# EAGLE board PXF_v2.0 (EAGLE 7.1.0), part 1 of 2
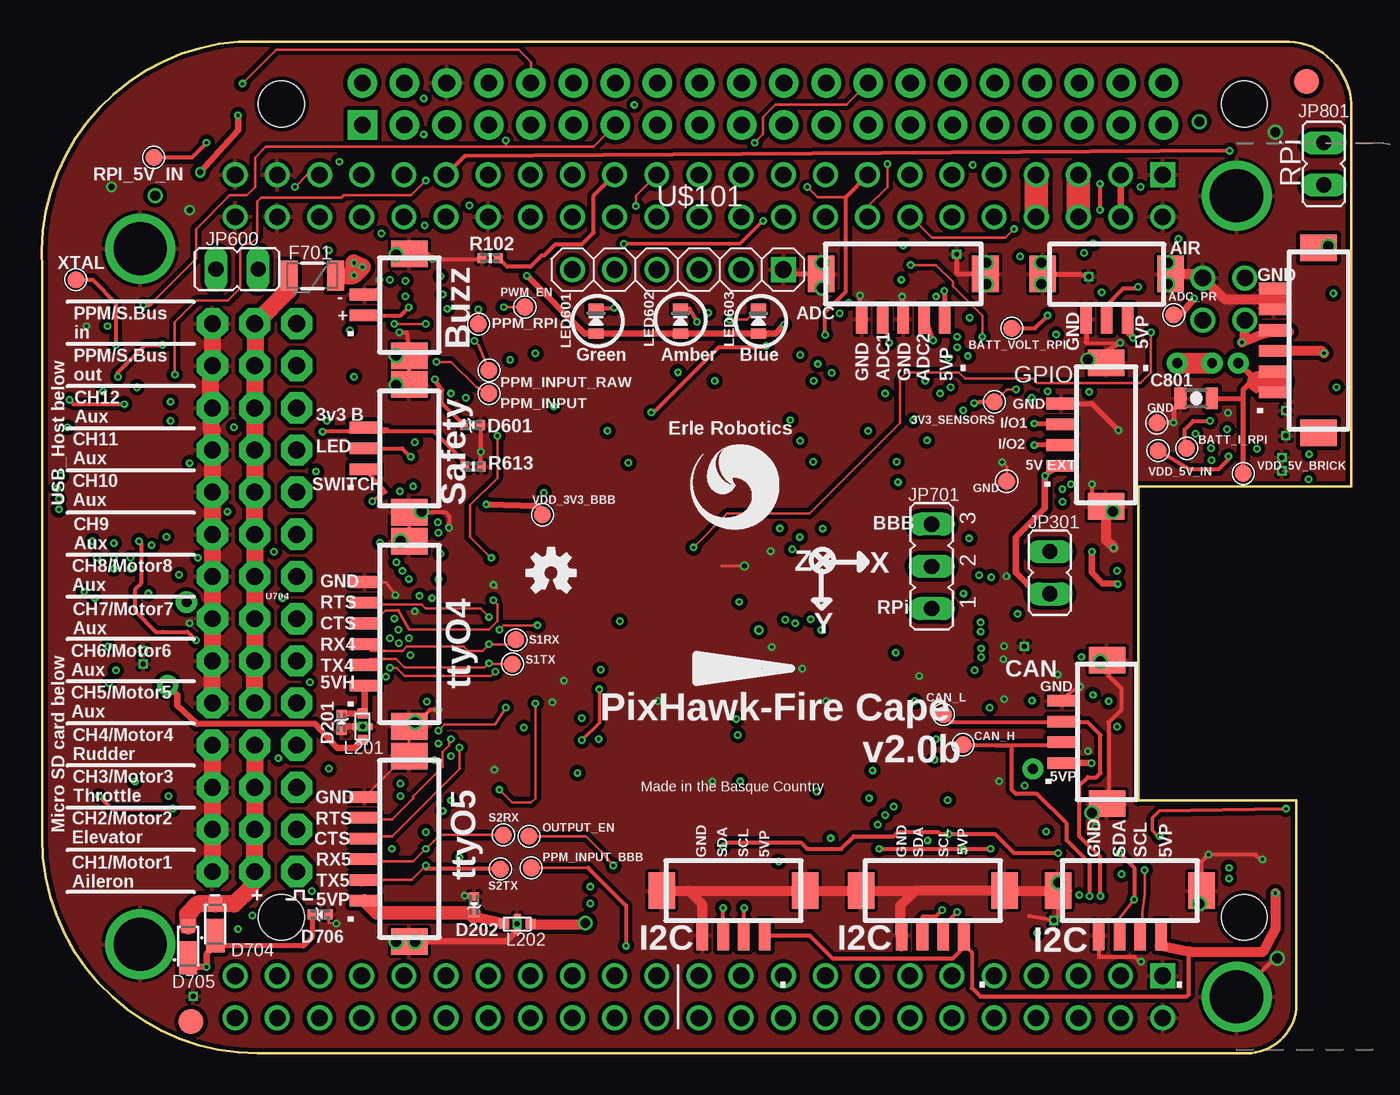
[diagram p9: board, top side]
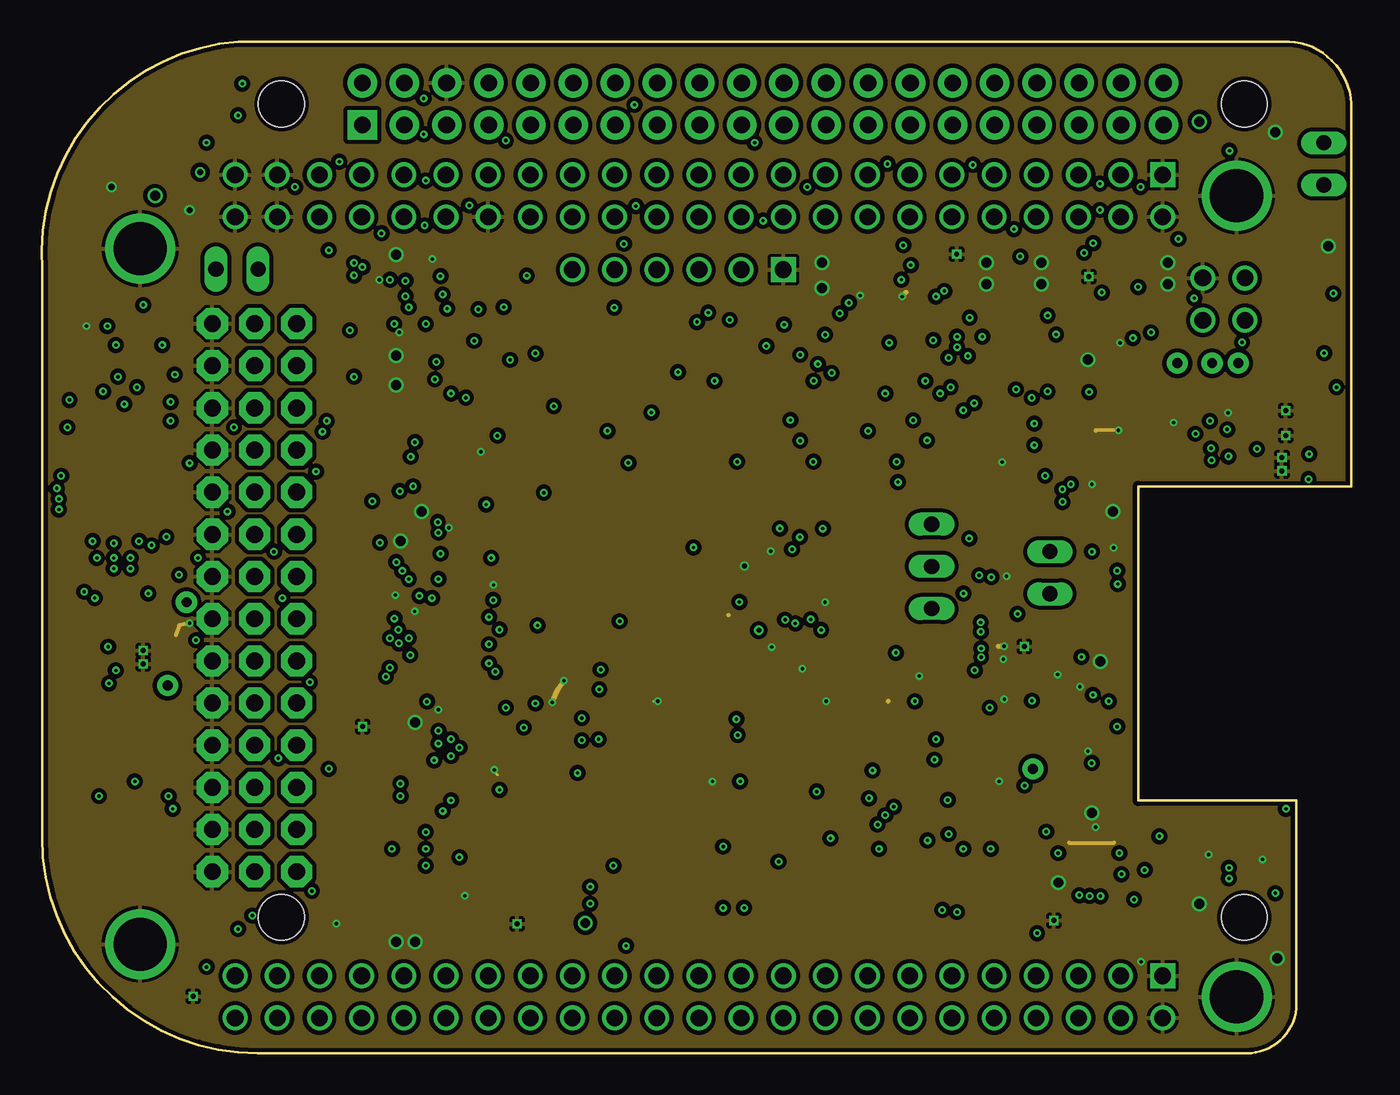
[diagram p10: board, inner layer Ground]
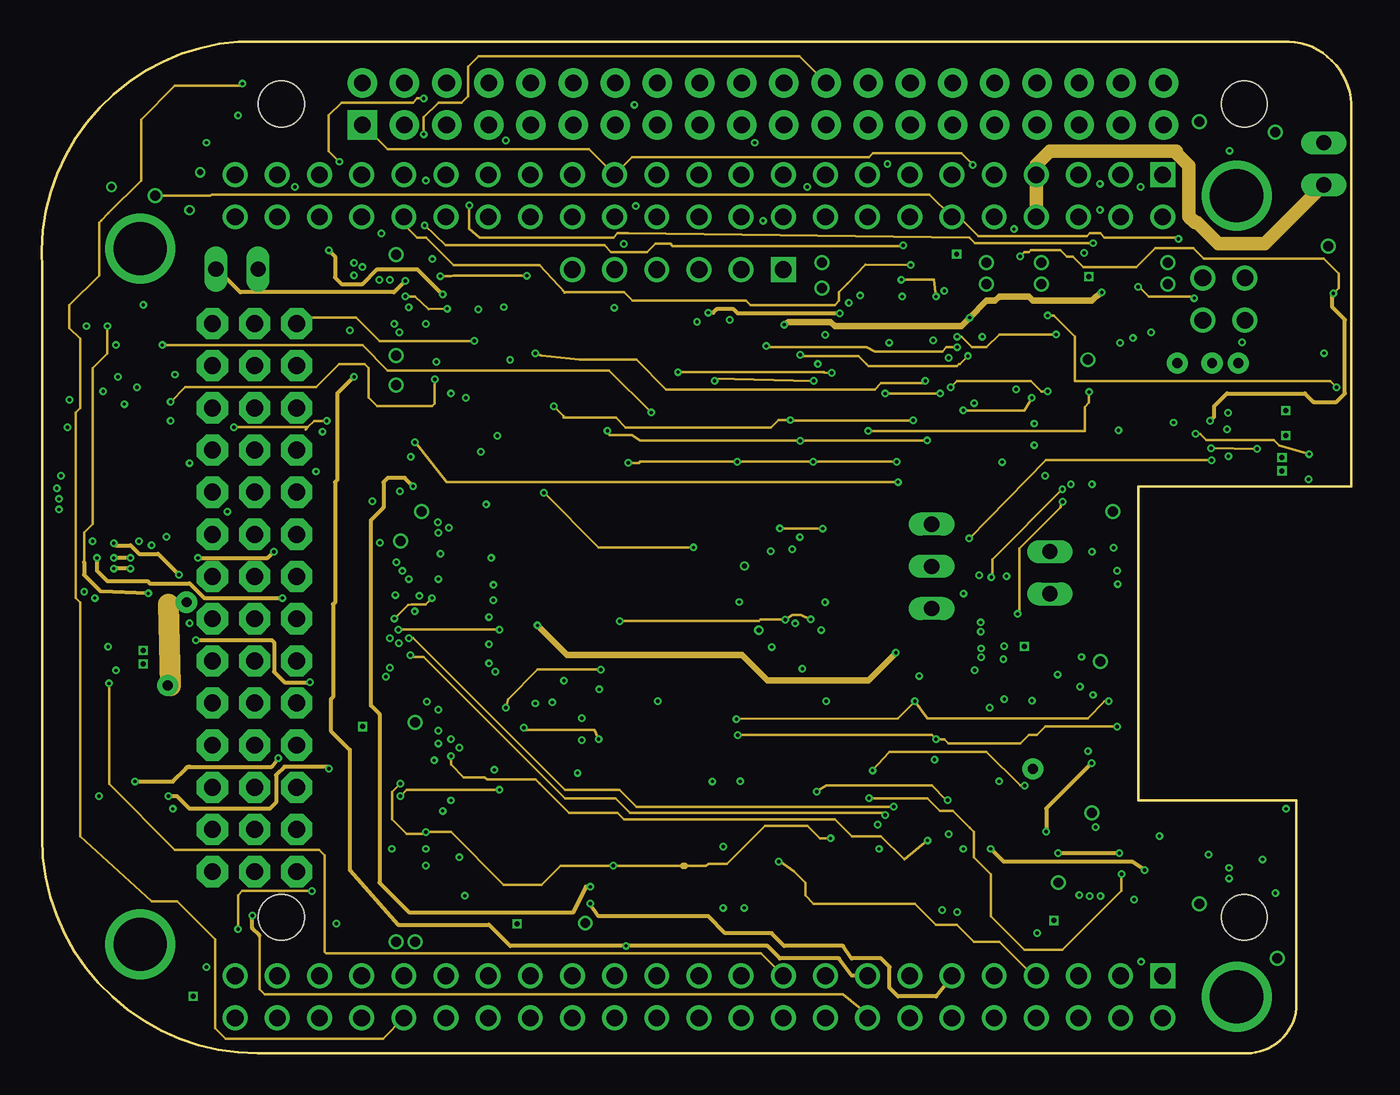
[diagram p11: board, inner layer Horizontal]
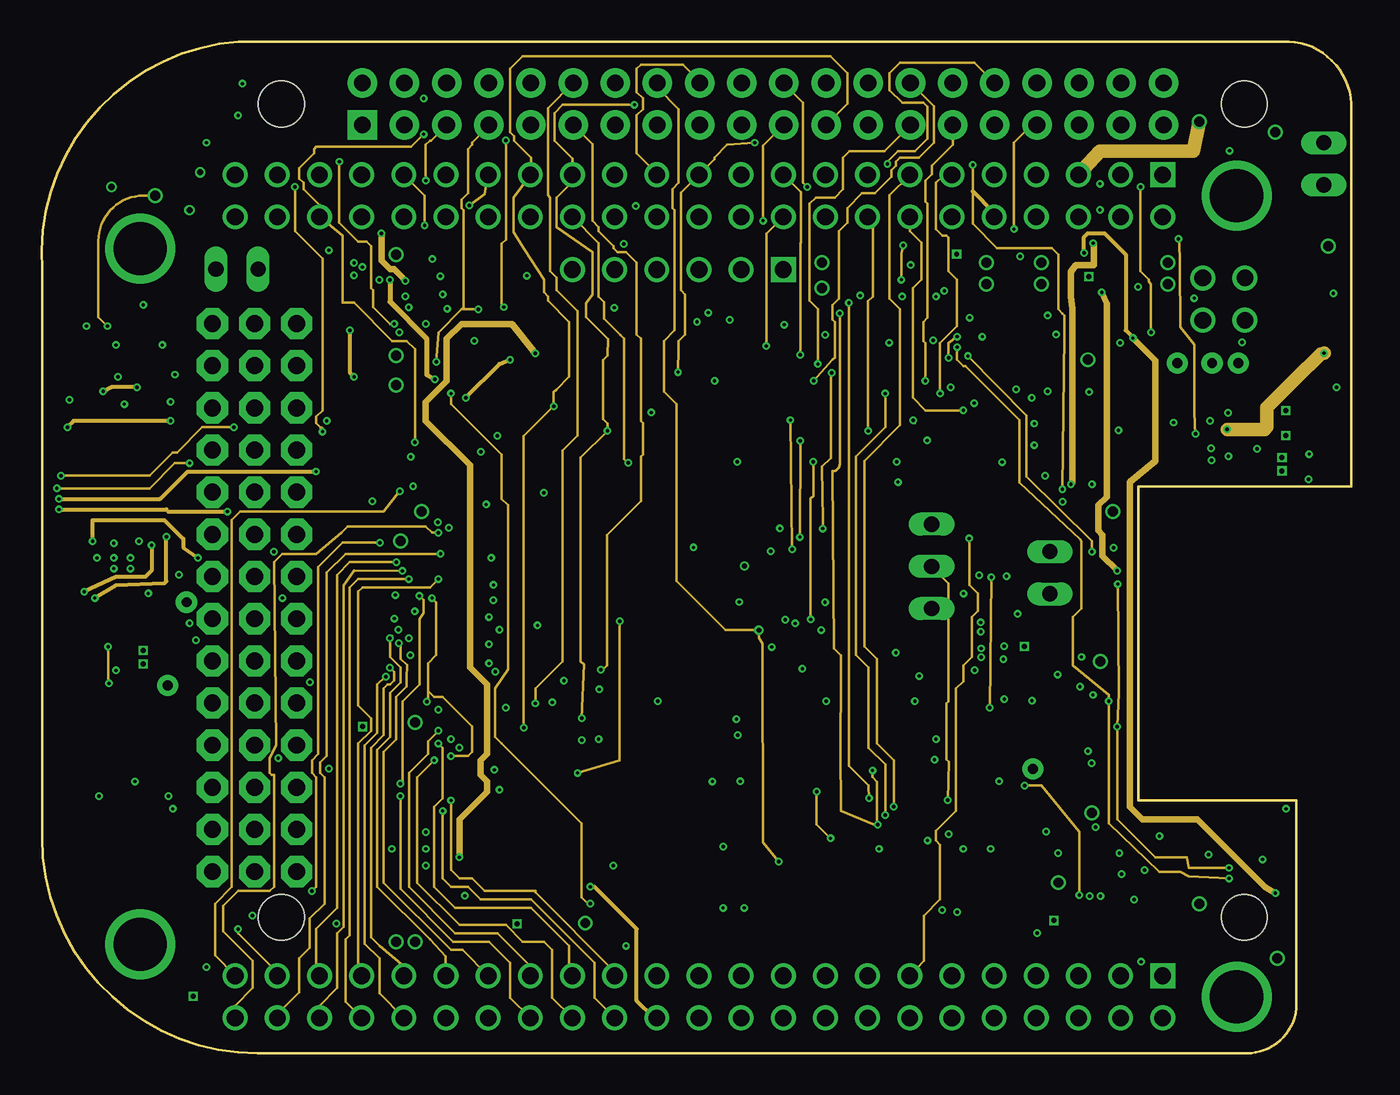
[diagram p12: board, inner layer Vertical]
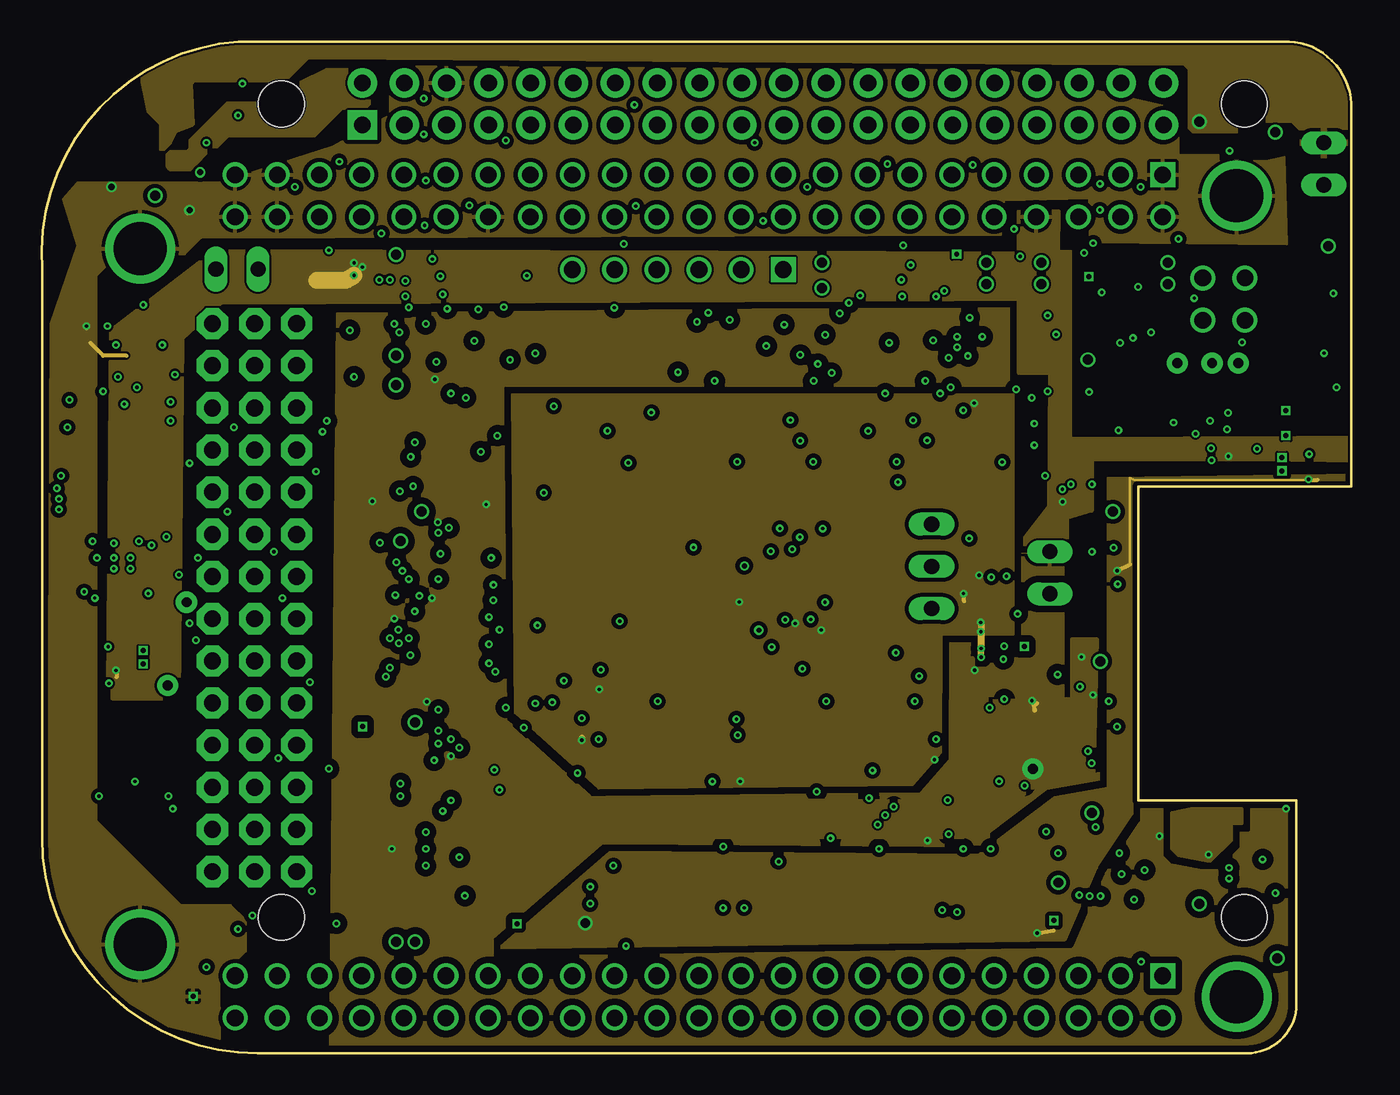
[diagram p13: board, inner layer Power]
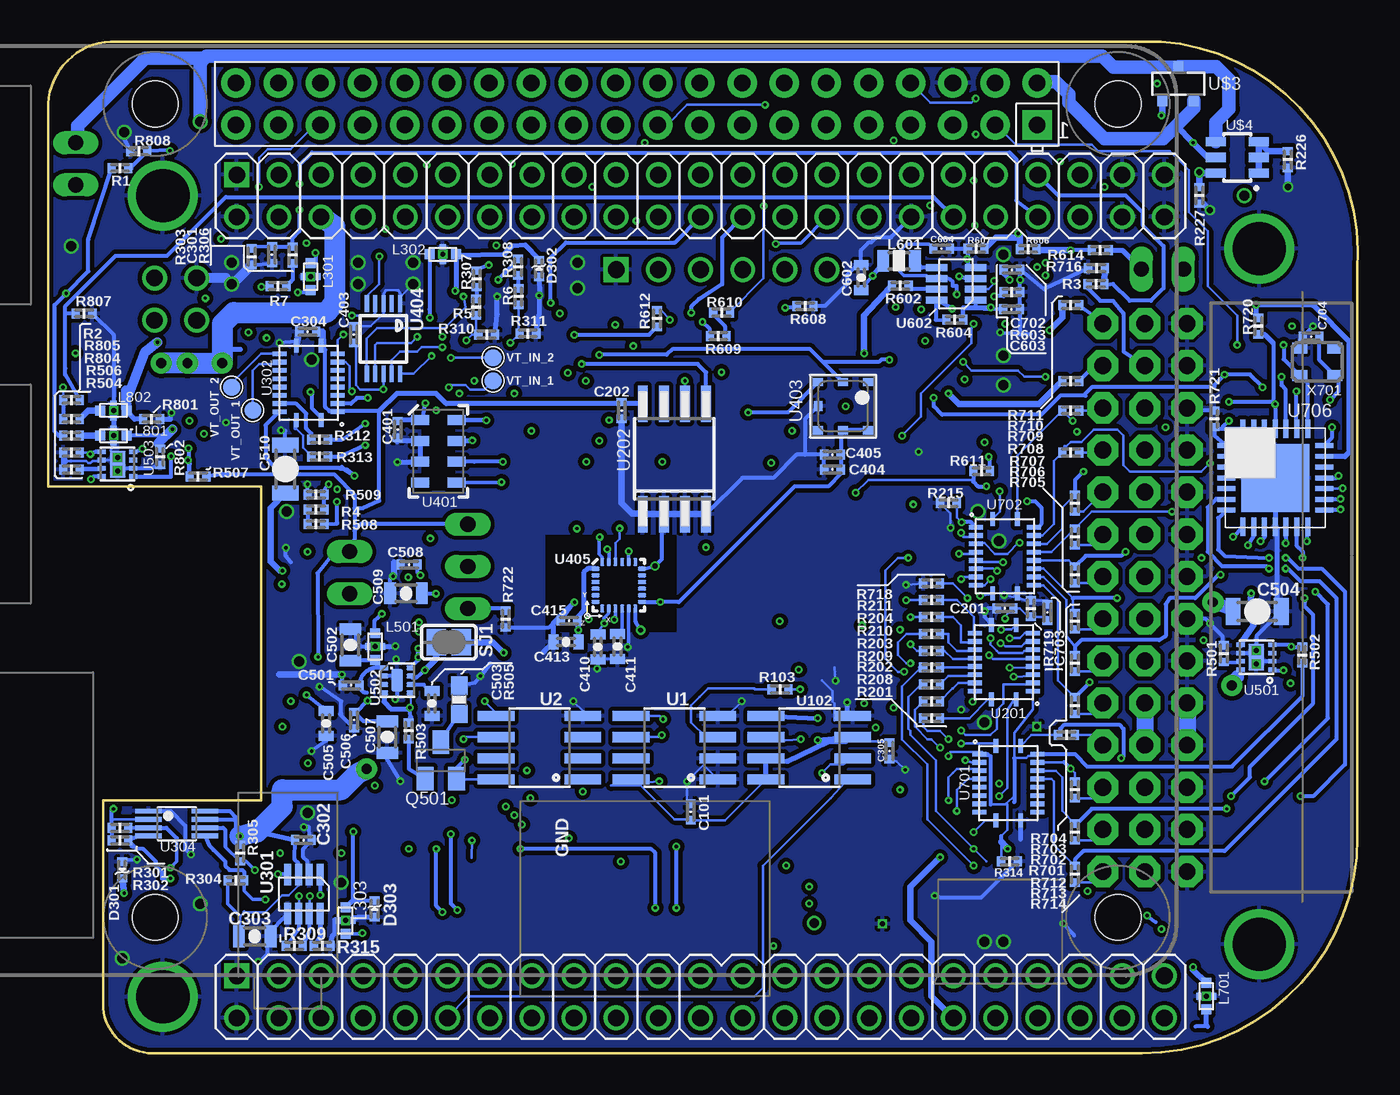
[diagram p14: board, bottom side, seen from below]

Size 78.9 x 60.96 mm. Coordinates in mm from the lower left corner, seen from the top.
Outline: 74.76,60.96 11.89,60.96 arc90 0.03,47.2 0.03,13 arc90 13.03,0 72.6,0 arc90 75.6,3 75.6,15.24 66.07,15.24 66.07,34.16 78.9,34.16 78.9,57.2 arc90 74.76,60.96
Copper layers (1*2*3*14*15*16): Top 0.035mm / dielectric 0.5mm / Ground 0.035mm / dielectric 0.15mm / Horizontal 0.035mm / dielectric 0.15mm / Vertical 0.035mm / dielectric 0.15mm / Power 0.035mm / dielectric 0.5mm / Bottom 0.035mm
Design rules "3DR 5mil *": minimum track width 0.125mm, minimum drill 0.15mm, track to track 4mil, track to pad 4mil, pad to pad 4mil, via to via 4mil, smd to smd 1mil, copper to edge 0.125mm, drill to drill 0.125mm, minimum pad ring 0.125mm, minimum via ring 0.125mm, stop-mask expansion 1mil, vias tented up to drill 0.31mm, thermal gap 8mil
Net classes: 0 signal: width 0.127 mm, drill 0.2 mm, clearance 0.127 mm; 1 power: width 0.127 mm, drill 0.2 mm, clearance 0.127 mm

## Footprints (pad centres in the part's own frame; a part is rotated, then mirrored left to right if it is on the bottom)
PAD.04X.04 = smd 1.016 x 1.016: P$1 0,0
0402-CAP = smd 0.5 x 0.6: P$1 -0.5,0; P$2 0.5,0
0805-CAP = smd 0.7 x 1.3: P$1 -0.95,0; P$2 0.95,0
0603-CAP = smd 0.6 x 0.9: P$1 -0.75,0; P$2 0.75,0
1206-CAP = smd 0.9 x 1.6: P$1 -1.45,0; P$2 1.45,0
0402-TVS = smd 0.5 x 0.6: A 0.5,0; C -0.5,0
MICROSMP = smd 0.8 x 0.8: ANODE 0.65,0 | smd 2 x 1.1: CATHODE -1.25,0
PTC-1206 = smd 1 x 1.8: 1 -1.4,0; 2 1.4,0
DF13C-3P-1.25V = smd 0.7 x 1.8: 1 -1.25,0.9; 2 0,0.9; 3 1.25,0.9 | smd 1.6 x 2.2: P$4 -3.85,-1.8; P$5 3.85,-1.8
DF13C-4P-1.25V = smd 0.7 x 1.8: 1 -1.875,0.9; 2 -0.625,0.9; 3 0.625,0.9; 4 1.875,0.9 | smd 1.6 x 2.2: P$5 -4.325,-1.8; P$6 4.325,-1.8
DF13C-5P-1.25V = smd 0.7 x 1.8: 1 -2.5,0.9; 2 -1.25,0.9; 3 0,0.9; 4 1.25,0.9; 5 2.5,0.9 | smd 1.6 x 2.2: P$6 -4.95,-1.8; P$7 4.95,-1.8
DF13C-6P-1.25V = smd 0.7 x 1.8: 1 -3.125,0.9; 2 -1.875,0.9; 3 -0.625,0.9; 4 0.625,0.9; 5 1.875,0.9; 6 3.125,0.9 | smd 1.6 x 2.2: M$0 5.575,-1.8; M$1 -5.575,-1.8
JP1 = drill 0.914 long: 1 0,-1.27; 2 0,1.27
JP2 = drill 0.914 long: 1 -2.54,0; 2 0,0; 3 2.54,0
FIDUCIAL-1.5X3 = smd 1.5 x 1.5: 1 0,0
KYOCERA-KNH16-DA = smd 0.6 x 0.6: P$1 -0.8,0; P$2 0.8,0 | smd 0.4 x 0.4: P$3 0,-0.4; P$4 0,0.4 | drill 0.3 pad 0.4 square: P$5 0,0
0805-IND = smd 0.7 x 1.3: P$1 -0.95,0; P$2 0.95,0
0603-LED = smd 0.6 x 0.9: A 0.75,0; C -0.75,0
SOT23-BEC = smd 1 x 1.4: B -0.95,-1.1; C 0,1.1; E 0.95,-1.1
0402-RES = smd 0.5 x 0.6: P$1 -0.5,0; P$2 0.5,0
0603-RES = smd 1.1 x 1: 1 -0.85,0; 2 0.85,0
SOLDERJUMPER_CLOSEDWIRE = smd 1.168 x 1.6: 1 -0.762,0; 2 0.762,0 | smd 0.635 x 0.203: WIRE 0,0
SO08 = smd 0.61 x 2.21: 1 -1.905,-2.616; 2 -0.635,-2.616; 3 0.635,-2.616; 4 1.905,-2.616; 5 1.905,2.616; 6 0.635,2.616; 7 -0.635,2.616; 8 -1.905,2.616
QFN20-RGY = smd 0.28 x 0.85: 1 -0.75,2.25; 10 -0.75,-2.25; 11 0.75,-2.25; 20 0.75,2.25 | smd 0.85 x 0.28: 2 -1.75,1.75; 3 -1.75,1.25; 4 -1.75,0.75; 5 -1.75,0.25; 6 -1.75,-0.25; 7 -1.75,-0.75; 8 -1.75,-1.25; 9 -1.75,-1.75; 12 1.75,-1.75; 13 1.75,-1.25; 14 1.75,-0.75; 15 1.75,-0.25; 16 1.75,0.25; 17 1.75,0.75; 18 1.75,1.25; 19 1.75,1.75
SOIC8 = smd 0.6 x 2.2: 1 -1.905,-3.33; 2 -0.635,-3.33; 3 0.635,-3.33; 4 1.905,-3.33; 5 1.905,3.33; 6 0.635,3.33; 7 -0.635,3.33; 8 -1.905,3.33
SOT23-8 = smd 0.42 x 1.3: 1 -0.975,-1.175; 2 -0.325,-1.175; 3 0.325,-1.175; 4 0.975,-1.175; 5 0.975,1.175; 6 0.325,1.175; 7 -0.325,1.175; 8 -0.975,1.175
DCT = smd 0.3 x 1.6: P$1 0.52,-1.7; P$2 1.02,-1.7; P$3 1.52,-1.7; P$4 2.02,-1.7; P$5 2.02,1.7; P$6 1.52,1.7; P$7 1.02,1.7; P$8 0.52,1.7
MS5611-01BA = smd 1.1 x 0.6: 1 -1.1,1.875; 2 -1.1,0.625; 3 -1.1,-0.625; 4 -1.1,-1.875; 5 1.1,-1.875; 6 1.1,-0.625; 7 1.1,0.625; 8 1.1,1.875
BMP180 = smd 0.6 x 0.5: 1 1.5,1.45; 2 0,1.45; 3 -1.5,1.45; 4 -1.5,-1.45; 5 0,-1.45; 6 1.5,-1.45 | smd 0.5 x 0.6: 7 1.5,0
MSOP10 = smd 0.25 x 1: 1 -1,-2.113; 2 -0.5,-2.113; 3 0,-2.113; 4 0.5,-2.113; 5 1,-2.113; 6 1,2.113; 7 0.5,2.113; 8 0,2.113; 9 -0.5,2.113; 10 -1,2.113
MPU-6500 = smd 0.508 x 0.254: 1 -1.4,1; 2 -1.4,0.6; 3 -1.4,0.2; 4 -1.4,-0.2; 5 -1.4,-0.6; 6 -1.4,-1; 13 1.4,-1; 14 1.4,-0.6; 15 1.4,-0.2; 16 1.4,0.2; 17 1.4,0.6; 18 1.4,1 | smd 0.254 x 0.508: 7 -1,-1.4; 8 -0.6,-1.4; 9 -0.2,-1.4; 10 0.2,-1.4; 11 0.6,-1.4; 12 1,-1.4; 19 1,1.4; 20 0.6,1.4; 21 0.2,1.4; 22 -0.2,1.4; 23 -0.6,1.4; 24 -1,1.4
QFN8-DSG = smd 0.28 x 0.5: 1 -0.75,-0.95; 2 -0.25,-0.95; 3 0.25,-0.95; 4 0.75,-0.95; 5 0.75,0.95; 6 0.25,0.95; 7 -0.25,0.95; 8 -0.75,0.95 | smd 1.6 x 0.9: GND 0,0 | drill 0.3 square: P$2 -0.4,0; P$3 0.4,0
MLF-8-EPAD = smd 0.5 x 0.3: 1 -0.8,0.75; 2 -0.8,0.25; 3 -0.8,-0.25; 4 -0.8,-0.75; 5 0.8,-0.75; 6 0.8,-0.25; 7 0.8,0.25; 8 0.8,0.75 | smd 0.7 x 1.4: GND 0,0
3X14RA = drill 1.016 pad 1.88 octagon: 1 2.54,-16.51; 2 0,-16.51; 3 -2.54,-16.51; 4 2.54,-13.97; 5 0,-13.97; 6 -2.54,-13.97; 7 2.54,-11.43; 8 0,-11.43; 9 -2.54,-11.43; 10 2.54,-8.89; 11 0,-8.89; 12 -2.54,-8.89; 13 2.54,-6.35; 14 0,-6.35; 15 -2.54,-6.35; 16 2.54,-3.81; 17 0,-3.81; 18 -2.54,-3.81; 19 2.54,-1.27; 20 0,-1.27; 21 -2.54,-1.27; 22 2.54,1.27; 23 0,1.27; 24 -2.54,1.27; 25 2.54,3.81; 26 0,3.81; 27 -2.54,3.81; 28 2.54,6.35; 29 0,6.35; 30 -2.54,6.35; 31 2.54,8.89; 32 0,8.89; 33 -2.54,8.89; 34 2.54,11.43; 35 0,11.43; 36 -2.54,11.43; 37 2.54,13.97; 38 0,13.97; 39 -2.54,13.97; 40 2.54,16.51; 41 0,16.51; 42 -2.54,16.51
HVQFN28 = smd 1.1 x 0.3: 1 -2.95,1.95; 2 -2.95,1.3; 3 -2.95,0.65; 4 -2.95,0; 5 -2.95,-0.65; 6 -2.95,-1.3; 7 -2.95,-1.95; 15 2.95,-1.95; 16 2.95,-1.3; 17 2.95,-0.65; 18 2.95,0; 19 2.95,0.65; 20 2.95,1.3; 21 2.95,1.95 | smd 0.3 x 1.1: 8 -1.95,-2.95; 9 -1.3,-2.95; 10 -0.65,-2.95; 11 0,-2.95; 12 0.65,-2.95; 13 1.3,-2.95; 14 1.95,-2.95; 22 1.95,2.95; 23 1.3,2.95; 24 0.65,2.95; 25 0,2.95; 26 -0.65,2.95; 27 -1.3,2.95; 28 -1.95,2.95 | smd 4.1 x 4.1: PAD 0,0
DF13C-6P-1.25V' = smd 0.7 x 1.8: 1 -3.125,0.9; 2 -1.875,0.9; 3 -0.625,0.9; 4 0.625,0.9; 5 1.875,0.9; 6 3.125,0.9 | smd 1.6 x 2.2: P$7 -5.575,-1.8; P$8 5.575,-1.8
SOT23 = smd 0.6 x 0.7: D 0,1; G -0.95,-1; S 0.95,-1
SOT26 = smd 0.55 x 1.2: 1 2.22,-1.3; 2 1.27,-1.3; 3 0.32,-1.3; 4 0.32,1.3; 5 1.27,1.3; 6 2.22,1.3
DF13C-2P-1.25V = smd 0.7 x 1.8: 1 -0.625,0.9; 2 0.625,0.9 | smd 1.6 x 2.2: P$3 -3.075,-1.8; P$4 3.075,-1.8
BEAGLEBONE_SHIELD = drill 1 square: 1 4.445,19.05; 47 52.705,19.05; 93 46.99,41.91 | drill 1: 2 1.905,19.05; 3 4.445,21.59; 4 1.905,21.59; 5 4.445,24.13; 6 1.905,24.13; 7 4.445,26.67; 8 1.905,26.67; 9 4.445,29.21; 10 1.905,29.21; 11 4.445,31.75; 12 1.905,31.75; 13 4.445,34.29; 14 1.905,34.29; 15 4.445,36.83; 16 1.905,36.83; 17 4.445,39.37; 18 1.905,39.37; 19 4.445,41.91; 20 1.905,41.91; 21 4.445,44.45; 22 1.905,44.45; 23 4.445,46.99; 24 1.905,46.99; 25 4.445,49.53; 26 1.905,49.53; 27 4.445,52.07; 28 1.905,52.07; 29 4.445,54.61; 30 1.905,54.61; 31 4.445,57.15; 32 1.905,57.15; 33 4.445,59.69; 34 1.905,59.69; 35 4.445,62.23; 36 1.905,62.23; 37 4.445,64.77; 38 1.905,64.77; 39 4.445,67.31; 40 1.905,67.31; 41 4.445,69.85; 42 1.905,69.85; 43 4.445,72.39; 44 1.905,72.39; 45 4.445,74.93; 46 1.905,74.93; 48 50.165,19.05; 49 52.705,21.59; 50 50.165,21.59; 51 52.705,24.13; 52 50.165,24.13; 53 52.705,26.67; 54 50.165,26.67; 55 52.705,29.21; 56 50.165,29.21; 57 52.705,31.75; 58 50.165,31.75; 59 52.705,34.29; 60 50.165,34.29; 61 52.705,36.83; 62 50.165,36.83; 63 52.705,39.37; 64 50.165,39.37; 65 52.705,41.91; 66 50.165,41.91; 67 52.705,44.45; 68 50.165,44.45; 69 52.705,46.99; 70 50.165,46.99; 71 52.705,49.53; 72 50.165,49.53; 73 52.705,52.07; 74 50.165,52.07; 75 52.705,54.61; 76 50.165,54.61; 77 52.705,57.15; 78 50.165,57.15; 79 52.705,59.69; 80 50.165,59.69; 81 52.705,62.23; 82 50.165,62.23; 83 52.705,64.77; 84 50.165,64.77; 85 52.705,67.31; 86 50.165,67.31; 87 52.705,69.85; 88 50.165,69.85; 89 52.705,72.39; 90 50.165,72.39; 91 52.705,74.93; 92 50.165,74.93; 94 46.99,44.45; 95 46.99,46.99; 96 46.99,49.53; 97 46.99,52.07; 98 46.99,54.61; TP5 43.942,14.097; TP6 46.482,14.097; TP7 43.942,16.637; TP8 46.482,16.637 | drill 3.2: P$1 6.35,80.645; P$2 48.26,80.645; P$3 3.175,14.605; P$4 51.435,14.605
RASPI_BOARD_B+_FULL = drill 1 pad 1.778 square: 1 8.37,51.23 | drill 1 pad 1.778: 2 8.37,53.77; 3 10.91,51.23; 4 10.91,53.77; 5 13.45,51.23; 6 13.45,53.77; 7 15.99,51.23; 8 15.99,53.77; 9 18.53,51.23; 10 18.53,53.77; 11 21.07,51.23; 12 21.07,53.77; 13 23.61,51.23; 14 23.61,53.77; 15 26.15,51.23; 16 26.15,53.77; 17 28.69,51.23; 18 28.69,53.77; 19 31.23,51.23; 20 31.23,53.77; 21 33.77,51.23; 22 33.77,53.77; 23 36.31,51.23; 24 36.31,53.77; 25 38.85,51.23; 26 38.85,53.77; 27 41.39,51.23; 28 41.39,53.77; 29 43.93,51.23; 30 43.93,53.77; 31 46.47,51.23; 32 46.47,53.77; 33 49.01,51.23; 34 49.01,53.77; 35 51.55,51.23; 36 51.55,53.77; 37 54.09,51.23; 38 54.09,53.77; 39 56.63,51.23; 40 56.63,53.77 | hole 2.75: 3.5,3.5; 3.5,52.5; 61.5,3.5; 61.5,52.5
ASE = smd 0.9 x 0.65: 1 -1.05,-0.825; 2 1.05,-0.825; 3 1.05,0.825; 4 -1.05,0.825

## Placement (x,y rotation side)
3V3_SENSORS  PAD.04  [PAD.04X.04]  57.4,39.25 90 top
ADC_PR  PAD.04  [PAD.04X.04]  68.21,44.49 90 top
BATT_I_RPI  PAD.04  [PAD.04X.04]  68.99,36.45 0 top
BATT_VOLT_RPI  PAD.04  [PAD.04X.04]  58.45,43.69 0 top
C101  0u1  [0402-CAP]  40.2,14.55 90 bottom
C201  0u1  [0402-CAP]  21.26,26.82 180 bottom
C202  100nF  [0402-CAP]  44.36,38.73 270 bottom
C301  0u1  [0402-CAP]  65.42,48.11 270 bottom
C302  0u1  [0402-CAP]  63.53,12.85 0 bottom
C303  10u/10V  [0805-CAP]  66.45,7.05 0 bottom
C304  0u1  [0402-CAP]  63.27,43.47 180 bottom
C305  0u1  [0402-CAP]  28.23,18.22 270 bottom
C401  0u1  [0402-CAP]  57.84,37.59 270 bottom
C403  0u1  [0402-CAP]  60.49,43.31 90 bottom
C404  1u  [0402-CAP]  31.66,35.18 180 bottom
C405  0u1  [0402-CAP]  31.66,36.07 180 bottom
C410  10n  [0603-CAP]  45.79,24.48 270 bottom
C411  2u2  [0603-CAP]  44.61,24.51 270 bottom
C413  2u2  [0603-CAP]  47.71,24.79 180 bottom
C415  u1F  [0402-CAP]  47.52,26.06 180 bottom
C501  0u1  [0402-CAP]  60.65,22.17 180 bottom
C502  10u  [0805-CAP]  60.69,24.61 90 bottom
C503  2u2  [0603-CAP]  55.79,21.08 270 bottom
C504  100u  [1206-CAP]  6.08,26.62 0 bottom
C505  1u  [0603-CAP]  62.16,19.88 270 bottom
C506  0u1  [0402-CAP]  60.48,20.08 270 bottom
C507  22u  [0805-CAP]  58.48,19.05 270 bottom
C508  0u1  [0402-CAP]  57.17,29.44 180 bottom
C509  22u  [0805-CAP]  57.35,27.71 180 bottom
C510  100u  [1206-CAP]  64.62,35.21 90 bottom
C602  1u0  [0603-CAP]  29.93,46.74 90 bottom
C603  5n6  [0402-CAP]  20.87,44.82 0 bottom
C604  0u47  [0402-CAP]  25.08,48.48 0 bottom
C702  0u1  [0402-CAP]  20.84,47.2 0 bottom
C703  0u1  [0402-CAP]  18.71,26.56 90 bottom
C704  0u1  [0402-CAP]  2.83,43.18 180 bottom
C801  22u/25V  [0805-CAP]  69.55,39.46 180 top
CAN_H  PAD.04  [PAD.04X.04]  55.51,18.59 180 top
CAN_L  PAD.04  [PAD.04X.04]  54.34,20.41 180 top
D201  PESD0402-140  [0402-TVS]  18.07,19.94 270 top
D202  PESD0402-140  [0402-TVS]  26.06,8.96 90 top
D301  PESD0402-140  [0402-TVS]  74.46,11.05 90 bottom
D302  PESD0402-140  [0402-TVS]  49.34,47.29 270 bottom
D303  PESD0402-140  [0402-TVS]  59.23,8.71 270 bottom
D601  PESD0402-140  [0402-TVS]  25.96,37.84 0 top
D704  DIODE-SCHOTTKY_MSMP  [MICROSMP]  10.47,8.34 90 top
D705  DIODE-SCHOTTKY_MSMP  [MICROSMP]  8.84,7.01 90 top
D706  PESD0402-140  [0402-TVS]  16.79,8.38 0 top
F701  0ZCA0035FF2G  [PTC-1206]  16.32,46.85 180 top
GND  PAD.04  [PAD.04X.04]  67.2,37.99 0 top
GND.  PAD.04  [PAD.04X.04]  58.14,34.46 90 top
J305  DF13-3P-1.25V  [DF13C-3P-1.25V]  64.17,45.15 180 top
J306  DF13-4P-1.25V  [DF13C-4P-1.25V]  53.69,8 180 top
J307  DF13-4P-1.25V  [DF13C-4P-1.25V]  62.39,19.37 90 top
J308  DF13-4P-1.25V  [DF13C-4P-1.25V]  62.33,37.27 90 top
J309  DF13-5P-1.25V  [DF13C-5P-1.25V]  51.91,45.15 180 top
J310  DF13-4P-1.25V  [DF13C-4P-1.25V]  41.69,8 180 top
J314  DF13-4P-1.25V  [DF13C-4P-1.25V]  65.57,8 180 top
J801  DF13C-6P-1.25V  [DF13C-6P-1.25V]  75.14,42.95 90 top
JP301  [JP1]  60.74,28.96 0 top
JP600  [JP1]  11.78,47.24 90 top
JP701  M20-9990346  [JP2]  53.63,29.34 90 top
JP801  [JP1]  77.25,53.59 0 top
JP901  FIDUCIAL1.5X3  [FIDUCIAL-1.5X3]  76.21,58.55 0 top
JP902  FIDUCIAL1.5X3  [FIDUCIAL-1.5X3]  9.01,1.91 0 top
L201  KNH16C104DA5TS  [KYOCERA-KNH16-DA]  19.34,19.69 90 top
L202  KNH16C104DA5TS  [KYOCERA-KNH16-DA]  28.66,7.79 180 top
L301  KNH16C104DA5TS  [KYOCERA-KNH16-DA]  63.09,46.79 90 bottom
L302  KNH16C104DA5TS  [KYOCERA-KNH16-DA]  55.13,48.14 0 bottom
L303  KNH16C104DA5TS  [KYOCERA-KNH16-DA]  60.99,8 90 bottom
L501  KNH16C104DA5TS  [KYOCERA-KNH16-DA]  59.21,24.51 270 bottom
L601  47uH  [0805-IND]  27.64,47.75 0 bottom
L701  KNH16C104DA5TS  [KYOCERA-KNH16-DA]  9.13,3.44 270 bottom
L801  KNH16C104DA5TS  [KYOCERA-KNH16-DA]  74.96,37.21 180 bottom
L802  KNH16C104DA5TS  [KYOCERA-KNH16-DA]  74.96,38.73 180 bottom
LED601  GREEN  [0603-LED]  33.41,44.12 270 top
LED602  AMBER  [0603-LED]  38.49,44.12 270 top
LED603  BLUE  [0603-LED]  43.19,44.12 270 top
OSHW_LOGO  OSHW-LOGOS  [OSHW-LOGO-S]  30.69,28.95 0 top
OUTPUT_EN  PAD.04  [PAD.04X.04]  29.37,13.08 0 top
PPM_INPUT  PAD.04  [PAD.04X.04]  26.96,39.75 0 top
PPM_INPUT_BBB  PAD.04  [PAD.04X.04]  29.5,11.18 0 top
PPM_INPUT_RAW  PAD.04  [PAD.04X.04]  26.96,41.15 0 top
PPM_RPI  PAD.04  [PAD.04X.04]  26.32,43.94 0 top
PWM_EN  PAD.04  [PAD.04X.04]  29.12,44.96 0 top
Q501  MMBT3906LT1SMD  [SOT23-BEC]  55.25,17.64 0 bottom
R1  10K/0.1%  [0402-RES]  74.58,53.34 180 bottom
R2  10K/0.1%  [0402-RES]  77.5,39.37 180 bottom
R3  100K/0.1%  [0402-RES]  15.78,46.35 180 bottom
R4  10K/0.1%  [0402-RES]  62.77,32.77 180 bottom
R5  10K/0.1%  [0402-RES]  53.12,44.96 270 bottom
R6  10K/0.1%  [0402-RES]  50.58,45.59 270 bottom
R7  10K/0.1%  [0402-RES]  65.06,46.23 180 bottom
R102  10M/0.1%  [0402-RES]  27.03,47.92 0 top
R103  4.75K/0.1%  [0402-RES]  34.81,21.93 0 bottom
R201  120R  [0402-RES]  25.69,20.19 180 bottom
R202  120R  [0402-RES]  25.69,22.23 180 bottom
R203  120R  [0402-RES]  25.69,24.26 180 bottom
R204  120R  [0402-RES]  25.69,26.29 180 bottom
R208  120R  [0402-RES]  25.69,21.21 180 bottom
R209  120R  [0402-RES]  25.69,23.24 180 bottom
R210  120R  [0402-RES]  25.69,25.27 180 bottom
R211  120R  [0402-RES]  25.69,27.3 180 bottom
R215  10K  [0402-RES]  24.67,33.15 0 bottom
R226  47k  [0402-RES]  4.22,53.85 90 bottom
R227  47k  [0402-RES]  9.56,51.69 90 bottom
R301  1K5  [0402-RES]  74.58,13.59 180 bottom
R302  1K5  [0402-RES]  74.58,12.83 180 bottom
R303  10K/0.1%  [0402-RES]  66.64,47.99 90 bottom
R304  1K5  [0402-RES]  67.6,10.41 0 bottom
R305  1K5  [0402-RES]  67.34,12.06 270 bottom
R306  10K/0.1%  [0402-RES]  64.18,48.1 270 bottom
R307  10K/0.1%  [0402-RES]  53.08,46.66 270 bottom
R308  10K/0.1%  [0402-RES]  50.6,47.37 270 bottom
R309  120R  [0402-RES]  64.08,6.48 180 bottom
R310  10K/0.1%  [0402-RES]  52.48,43.31 180 bottom
R311  10K/0.1%  [0402-RES]  50.01,43.37 180 bottom
R312  220R  [0402-RES]  62.56,36.99 0 bottom
R313  220R  [0402-RES]  62.56,35.94 0 bottom
R314  10K  [0402-RES]  20.99,11.56 180 bottom
R315  0R  [0402-RES]  62.39,6.48 0 bottom
R501  16K5  [0402-RES]  8.08,24.08 90 bottom
R502  1M  [0402-RES]  3.37,24 270 bottom
R503  1k8  [0402-RES]  57.18,19.43 90 bottom
R504  25K  [0402-RES]  77.5,35.18 180 bottom
R505  10R  [0603-RES]  54.15,21.31 270 bottom
R506  10K  [0402-RES]  77.5,36.2 180 bottom
R507  1M  [0402-RES]  69.88,34.76 0 bottom
R508  10K/0.1%  [0402-RES]  62.77,31.88 0 bottom
R509  10K/0.1%  [0402-RES]  62.77,33.66 180 bottom
R602  9K09  [0402-RES]  27.58,46.24 180 bottom
R603  10K  [0402-RES]  20.85,45.85 0 bottom
R604  100K  [0402-RES]  24.29,44.2 180 bottom
R606  453K  [0402-RES]  19.87,48.46 180 bottom
R607  16K5  [0402-RES]  23.01,48.47 180 bottom
R608  220R  [0402-RES]  33.31,45.01 180 bottom
R609  220R  [0402-RES]  38.54,43.21 180 bottom
R610  220R  [0402-RES]  38.34,44.63 180 bottom
R611  68R  [0402-RES]  22.67,35.07 180 bottom
R612  220R  [0402-RES]  42.22,44.27 90 bottom
R613  1K5  [0402-RES]  26.01,35.34 0 top
R614  100K  [0402-RES]  15.53,48.39 0 bottom
R701  220R  [0402-RES]  17.56,19.18 0 bottom
R702  220R  [0402-RES]  17.05,20.96 270 bottom
R703  220R  [0402-RES]  17.05,23.5 270 bottom
R704  220R  [0402-RES]  17.05,26.04 270 bottom
R705  220R  [0402-RES]  17.05,28.83 270 bottom
R706  220R  [0402-RES]  17.05,31.12 270 bottom
R707  220R  [0402-RES]  17.05,33.15 270 bottom
R708  220R  [0402-RES]  17.31,36.2 0 bottom
R709  220R  [0402-RES]  17.31,38.73 0 bottom
R710  220R  [0402-RES]  17.31,40.51 0 bottom
R711  220R  [0402-RES]  17.31,45.09 0 bottom
R712  220R  [0402-RES]  17.05,15.88 270 bottom
R713  220R  [0402-RES]  17.05,13.33 270 bottom
R714  220R  [0402-RES]  17.05,10.79 270 bottom
R716  10K/0.1%  [0402-RES]  15.75,47.3 0 bottom
R718  10K  [0402-RES]  25.69,28.32 0 bottom
R719  10K  [0402-RES]  19.72,26.8 270 bottom
R720  10K  [0402-RES]  6,43.81 270 bottom
R721  10K  [0402-RES]  8.67,38.23 90 bottom
R722  10K  [0402-RES]  51.34,26.16 270 bottom
R801  1M  [0402-RES]  72.68,38.23 0 bottom
R802  1M  [0402-RES]  72.17,35.94 270 bottom
R804  10K/0.1%  [0402-RES]  77.5,37.21 0 bottom
R805  10K/0.1%  [0402-RES]  77.5,38.23 0 bottom
R807  10K/0.1%  [0402-RES]  76.74,44.58 0 bottom
R808  10K/0.1%  [0402-RES]  73.44,54.36 180 bottom
RPI_5V_IN  PAD.04  [PAD.04X.04]  6.76,53.97 0 top
S1RX  PAD.04  [PAD.04X.04]  28.58,24.91 0 top
S1TX  PAD.04  [PAD.04X.04]  28.37,23.46 0 top
S2RX  PAD.04  [PAD.04X.04]  27.82,13.16 90 top
S2TX  PAD.04  [PAD.04X.04]  27.64,11.11 0 top
SJ1  [SOLDERJUMPER_CLOSEDWIRE]  54.77,24.77 180 bottom
U1  EEPROM-I2CSMD  [SO08]  41.18,18.42 90 bottom
U2  EEPROM-I2CSMD  [SO08]  49.31,18.42 90 bottom
U102  FM25V01  [SO08]  33.05,18.42 90 bottom
U201  TXS0108QFN20  [QFN20-RGY]  21.33,23.56 180 bottom
U202  EEPROM24  [SOIC8]  41.18,35.81 0 bottom
U301  MAX3051  [SOT23-8]  63.5,9.59 180 bottom
U302  TXS0108QFN20  [QFN20-RGY]  63.21,40.39 180 bottom
U304  PCA9603  [DCT]  71.15,15.11 270 bottom
U401  MS5611-01BA  [MS5611-01BA]  55.4,36.27 0 bottom
U403  BMP180  [BMP180]  31.02,38.99 180 bottom
U404  ADS1115  [MSOP10]  58.71,43.05 180 bottom
U405  MPU-9250  [MPU-6500]  44.53,28.2 0 bottom
U501  BQ24315  [QFN8-DSG]  6.12,23.87 90 bottom
U502  MIC5332  [MLF-8-EPAD]  57.87,22.48 0 bottom
U503  BQ24315  [QFN8-DSG]  74.73,35.5 90 bottom
U602  LT3469  [SOT23-8]  24.21,46.35 90 bottom
U701  TXS0108QFN20  [QFN20-RGY]  21.06,16.28 0 bottom
U702  TXS0108QFN20  [QFN20-RGY]  21.27,29.95 0 bottom
U704  BBB_3X14_RA  [3X14RA]  12.83,27.46 0 top
U706  PCA9685  [HVQFN28]  4.99,34.67 0 bottom
U$2  DF13-6P-1.25V  [DF13C-6P-1.25V']  20.35,12.32 90 top
U$3  P-MOSFET  [SOT23]  10.83,58.42 0 bottom
U$4  DMMT5401  [SOT26]  7.27,52.7 90 bottom
U$11  DF13-2P-1.25  [DF13C-2P-1.25V]  20.35,45.09 90 top
U$12  DF13-3P-1.25V  [DF13C-3P-1.25V]  20.35,36.45 90 top
U$101  BEAGLEBONE_OUTLINE  [BEAGLEBONE_SHIELD]  86.6,0.23 90 top
U$201  DF13-6P-1.25V  [DF13C-6P-1.25V']  20.35,25.27 90 top
VDD_3V3_BBB  PAD.04  [PAD.04X.04]  30.18,32.45 270 top
VDD_5V_BRICK  PAD.04  [PAD.04X.04]  72.4,34.93 90 top
VDD_5V_IN  PAD.04  [PAD.04X.04]  67.27,36.32 0 top
VT_IN_1  PAD.04  [PAD.04X.04]  52.1,40.51 0 bottom
VT_IN_2  PAD.04  [PAD.04X.04]  52.1,41.91 0 bottom
VT_OUT_1  PAD.04  [PAD.04X.04]  66.58,38.73 0 bottom
VT_OUT_2  PAD.04  [PAD.04X.04]  67.85,40.13 0 bottom
X2  RASPI_BOARD_B+_F  [RASPI_BOARD_B+_FULL]  10.96,4.7 0 top
X701  ASE  [ASE]  2.45,41.66 180 bottom
XTAL  PAD.04  [PAD.04X.04]  2.07,46.61 0 top

## Tracks (layer width: path | path; a pad name or v marks a point on that pad's centre or on a via)
3V3_EN  (via drill 0.2)
  Top 0.254: R102.P$2 28.06,47.39 29.46,47.39 29.88,47.81 30.14,48.08 30.29,48.08 30.96,48.74 32.56,48.74 33.26,49.44 33.26,51.66 U$101.73
  Horizontal 0.152: v57.22,28.69 57.27,28.75 57.27,29.74 v61.5,33.98 | X2.1 19.42,55.93 20.86,54.48 32.98,54.48 U$101.73 35.59,53.99 49.84,53.99 50.07,54.23 55.41,54.23 v56.1,53.53
  Vertical 0.15: 61.5,44.58 61.25,44.83 61.25,48.13 60.87,48.51 57.56,48.51 56.1,49.97
  Vertical 0.152: v57.12,20.82 v57.22,28.69 | v61.5,33.98 61.63,43.31 61.63,44.45 61.5,44.58 | 56.1,49.97 56.1,51.94 v56.1,53.53
  Vertical 0.254: U$101.56 57.39,50.66 56.1,51.94
  Bottom 0.127: U502.5 57.07,20.87 v57.12,20.82
  Bottom 0.254: 57.07,20.27 v57.12,20.82
  Bottom 0.305: 57.07,20.27 R503.P$2 | U502.4 58.67,21.17 58.26,20.77 57.18,20.77 v57.12,20.82
!FRAM_CS
  Bottom 0.152: U102.1 30.89,16.32 31.78,15.37 35.85,11.3 35.85,3.94 36.36,3.43 53.63,3.43 U$101.12
!LED_AMBER  (via drill 0.2)
  Top 0.152: v35.81,51.04 35.81,51.67 U$101.71
  Vertical 0.152: U$101.71 37.07,53.01 35.85,54.23 35.85,56.52 36.23,56.9 36.23,57.53 35.85,57.91 35.85,59.31 36.1,59.56 38.64,59.56 39.65,58.56 X2.18 | X2.18 39.6,58.42 39.4,58.42 | 39.45,58.47 39.53,58.55 39.61,58.47 X2.18
  Bottom 0.152: R610.P$1 37.84,44.66 35.81,46.69 v35.81,51.04
!LED_BLUE  (via drill 0.2)
  Top 0.152: v46.13,52.2 46.74,51.59 48.46,51.59
  Top 0.254: U$101.61 49.77,52.9 48.46,51.59 48.46,45.89 47.21,44.64 v47.21,43.29
  Vertical 0.152: X2.22 44.73,58.43 45.88,57.28 45.88,52.45 v46.13,52.2
  Bottom 0.254: v47.21,43.29 42.7,43.29 R612.P$1
!LED_SAFETY  (via drill 0.2)
  Top 0.152: v66.84,43.43 66.84,41.02 66.2,40.39 59.98,40.39 59.72,40.64 55.66,40.64 55.28,41.02 52.1,41.02 51.72,40.64 51.72,37.97 46.26,32.51 41.31,32.51 v39.28,30.48
  Horizontal 0.152: v39.28,30.48 33.56,30.48 v30.26,33.78
  Horizontal 0.254: v33.05,10.03 32.8,10.03 32.04,8.51 22.13,8.51 20.35,10.29 20.35,20.45 19.85,20.96 19.85,32.13 20.61,32.89 20.61,34.42 20.86,34.67 21.88,34.67 v22.39,34.16
  Vertical 0.152: v66.2,52.2 66.2,47.12 66.71,46.61 66.71,46.48 66.84,46.35 v66.84,43.43
  Vertical 0.254: U$101.26 36.89,2.13 35.85,3.17 35.85,7.49 33.31,10.03 v33.05,10.03
  Bottom 0.152: X2.35 62.85,55.93 64.3,54.48 65.69,54.48 66.2,53.97 v66.2,52.2 | v30.26,33.78 29.5,34.54 23.17,34.54
  Bottom 0.254: R611.P$2 23.17,34.54 23.17,34.44 22.89,34.16 v22.39,34.16
!VDD_5V_HIPOWER_OC  (via drill 0.2)
  Horizontal 0.152: U$101.19 43.35,6.01 17.15,6.01 17.06,6.1 17.06,11.92 16.73,12.25 8.03,12.25 4.07,16.22 v4.07,22.29
  Vertical 0.152: v4.01,24.5 4.01,22.34 v4.07,22.29
  Bottom 0.254: R502.P$1 v4.01,24.5 4.2,24.62 U501.4
!VDD_5V_PERIPH_EN  (via drill 0.2, 0.6)
  Horizontal 0.15: 56.44,49.23 62.98,49.23 63.15,49.4 63.79,49.4 64.04,49.15 68.41,49.15 v68.49,49.07
  Horizontal 0.152: 56.44,49.23 55.28,50.39 U$101.58 53.5,51.74 10.24,51.74 10.17,51.67 v6.84,51.67 | v69.52,37.32 69.8,37.32 70.17,36.95 74.23,36.95 74.57,36.61 v76.37,36.1 | v3.97,43.81 3.97,42.16 3.08,41.27 3.08,31.88 2.57,31.37 2.57,29.59
  Horizontal 0.254: 2.57,29.59 2.57,28.83 3.57,27.84 v6.43,27.71
  Vertical 0.152: v68.49,49.07 68.55,49 68.59,47.51 68.61,43.76 69.45,42.7 69.45,41.1 69.45,41.8 69.45,38.6 v69.52,37.32 | v6.84,51.67 6.15,51.67 arc90 3.43,48.95 3.43,44.36 v3.97,43.81
  Bottom 0.15: R506.P$1 75.73,36.2 U503.5
  Bottom 0.254: U503.5 76,36.25 v76.37,36.1
  Bottom 0.406: v6.43,27.71 6.45,27.31 6.32,25.78 7,24.8 U501.5
!VDD_5V_PERIPH_OC  (via drill 0.2)
  Horizontal 0.152: v73.22,36.42 70.47,36.46 v70.45,36.44 | v70.49,35.73 60.5,35.73 v55.89,31.02
  Vertical 0.15: 55.1,19.39 55.1,14.62 53.88,13.4 53.88,12.83 54.14,12.57 54.14,9.27 53.15,8.29 53.15,5.57 | 56.4,27.06 56.4,26.65 56.04,26.29 56.04,23.88 55.53,23.37 55.53,22.41 55.1,21.97
  Vertical 0.152: v55.89,31.02 55.89,28.22 56.4,27.71 56.4,27.06 | 55.1,21.97 55.1,19.39 | 53.15,5.57 U$101.13
  Bottom 0.254: U503.4 73.69,36.25 v73.22,36.42 | v70.45,36.44 70.45,34.82 R507.P$1 70.38,35.52 v70.49,35.73
ALARM  (via drill 0.2)
  Horizontal 0.152: v53.25,40.51 53.12,40.39 50.58,40.39 50.2,40 37.63,40 35.85,41.78 32.42,41.78 30.13,42.04 v29.75,42.16
  Vertical 0.152: X2.29 54.9,54.74 53.63,53.47 53.63,52.96 53.25,52.58 53.25,51.31 53.37,51.18 53.37,44.32 53.12,44.07 53.12,42.93 53.25,42.8 v53.25,40.51
  Vertical 0.406: v29.75,42.16 28.35,43.94 25.31,43.94 24.42,43.05 24.42,40.51 23.15,39.24 23.15,38.1 25.81,35.43 25.81,23.24 26.83,22.23 26.83,18.03 26.45,17.65 26.45,16.76 26.83,16.38 26.83,15.75 25.18,14.1 v25.18,11.81
  Bottom 0.152: 28.22,46.1 28.23,46.1
  Bottom 0.406: U$101.36 24.39,2.13 25.69,3.43 25.69,6.73 26.96,8 26.96,10.03 v25.18,11.81 | 28.22,46.1 R602.P$2 | 28.23,46.1 29.75,44.45 v29.75,42.16
AUX_ADC1  (via drill 0.2)
  Horizontal 0.152: v23.08,49.88 24.34,48.68 33.9,48.68 34.32,48.26 36.48,48.26 36.99,48.77 37.88,48.77 38.01,48.64 51.87,48.64 v51.91,48.68 | v51.8,46.61 53.75,46.61 v53.88,45.59
  Vertical 0.152: v51.8,46.61 51.8,48.18 v51.91,48.68 | v23.08,49.88 23.08,51.68 U$101.83
  Bottom 0.152: v53.88,45.59 53.75,44.96 55.02,43.69 59.09,43.69 59.72,43.05 59.72,40.96 U404.6
  Bottom 0.254: R308.P$1 51.2,47.21 v51.8,46.61
AUX_ADC2  (via drill 0.2)
  Top 0.152: v52.37,47.49 53.89,47.49 54.9,46.48 54.9,46.23 56.68,44.45 v56.68,43.18
  Horizontal 0.15: 24.84,47.48 23.17,49.15 22.64,49.15 21.83,49.96 U$101.84 | 48.54,46.36 48.04,45.86 48.04,45.34 47.79,45.09 42.71,45.09 42.45,45.34 35.59,45.34 35.09,45.85 31.52,45.85 | 31.52,45.85 31.4,45.96 | 31.52,45.85 31.52,45.84 31.53,45.83
  Horizontal 0.152: 24.84,47.48 30.01,47.49 31.53,45.83 | 48.54,46.36 49.64,47.5 v52.37,47.49
  Bottom 0.152: U404.7 59.21,42.68 59.09,42.8 57.06,42.8 v56.68,43.18
  Bottom 0.254: v52.37,47.49 52.99,47.25 R307.P$1
BATT_CURRENT_SENS  (via drill 0.2)
  Top 0.254: v71.56,54.38 25.5,54.06 U$101.81
  Bottom 0.254: 71.54,54.4 R808.P$1 73.96,53.34
  Bottom 0.406: 73.96,53.34 R1.P$1 | v71.56,54.38 71.54,54.38 71.54,54.4
BATT_CURRENT_SENS_PROT  (via drill 0.2)
  Top 0.61: J801.3 77.12,42.33 v77.27,42.18
  Vertical 0.813: v71.43,37.59 73.69,37.59 73.82,37.72 73.82,38.9 75.54,40.61 77.06,42.14 v77.27,42.18
  Bottom 0.254: R802.P$1 72.27,36.75 72.17,37.21 L801.P$1
  Bottom 0.61: v71.43,37.59 71.48,37.54 72.27,36.75
BATT_I_RPI  (via drill 0.2)
  Top 0.254: BATT_I_RPI.P$1 68.87,36.58 68.87,37.59 69.38,38.1 v70.39,38.1
  Horizontal 0.152: v58.96,48.01 59.22,48.26 59.47,48.26 59.6,48.39 61.37,48.39 61.76,48.01 62.14,48.01 62.77,47.37 65.95,47.37 67.09,48.51 69.38,48.51 70.01,47.88 77.25,47.88 78.14,46.99 78.14,46.1 v77.82,45.78
  Horizontal 0.254: v70.39,38.1 70.65,38.35 70.65,38.99 71.41,39.75 76.11,39.75 76.61,39.24 78.01,39.24 78.52,39.75 78.52,44.2 77.76,44.96 77.76,45.72 v77.82,45.78
  Bottom 0.152: U404.5 59.71,45.61 58.96,46.35 v58.96,48.01
  Bottom 0.254: R804.P$1 78.27,37.21 78.52,37.46 78.52,45.09 v77.82,45.78 76.49,47.12 76.49,49.03 R1.P$2
BATT_VOLT_RPI  (via drill 0.2)
  Top 0.254: BATT_VOLT_RPI.P$1 59.85,43.69 v60.61,44.45
  Horizontal 0.152: v60.61,44.45 60.99,44.45 62.26,43.18 62.26,40.51 77.63,40.51 v78.01,40.13
  Bottom 0.152: U404.4 59.21,44.59 59.34,44.45 v60.61,44.45 | v78.01,40.13 R2.P$2
  Bottom 0.254: R2.P$2 78.01,38.23 R805.P$1
BATT_VOLTAGE_SENS
  Bottom 0.254: 77.87,44.58 77.87,41.27 77.88,40.88 R2.P$1 | U$101.82 25.57,51.59 68.21,51.59 71.74,48.06 74.84,48.06 77.87,45.03 77.87,44.58 | R807.P$1 77.87,44.58
BATT_VOLTAGE_SENS_PROT  (via drill 0.2)
  Top 0.61: J801.4 75.16,43.48 74.11,43.48 73.59,43.35 v72.32,42.84 72.5,43.01 U$101.TP5
  Bottom 0.305: R801.P$1 73.7,38.21 L802.P$1
  Bottom 0.61: L802.P$1 74.2,38.77 74.2,39.12 74.21,39.93 74.03,39.75 73.06,42.29 v72.32,42.84
BBB-VDD_3V3  (via drill 0.2, 0.6 pad 1.27)
  Top 0.2: v74.96,14.73 67.34,14.61 66.92,14.18 66.92,13.42 67.26,13.08 v67.34,13.08
  Top 0.254: 24.11,39.94 24.11,39.19 D601.C | U$12.1 20.72,33.81 v19.93,33.27 | v1.68,39.37 1.94,39.12 v4.99,39.12
  Top 0.305: 25.38,37.76 D601.C | 24.11,39.94 v23.7,40.61
  Top 0.406: v26.79,33.07 29.92,32.98 VDD_3V3_BBB.P$1
  Horizontal 0.15: v21.26,26.2 21.31,26.23 22.07,27.02 22.29,27.05 23.15,27.05 v23.53,27.43 | v53.37,12.83 51.98,11.68 50.58,13.08 48.81,13.08 47.8,14.1 35.09,14.1 34.7,14.48 31.78,14.48 30.01,16.26 | v24.67,17.91 24.67,17.4
  Horizontal 0.152: 24.67,17.4 25.43,16.64 26.7,16.64 26.83,16.51 29.75,16.51 30.01,16.26 | v7.78,39.24 8.67,40.13 16.54,40.13 17.94,41.53 19.46,41.53 19.72,41.27 19.72,39.5 20.23,38.99 23.53,38.99 23.7,39.16 v23.7,40.61
  Vertical 0.15: 23.47,27.25 v23.53,27.43 | 23.27,21.21 23.27,21.84 23.66,21.46 24.16,21.46 25.94,19.69 25.94,18.16 25.69,17.91 24.8,17.91 24.67,17.78 v24.67,17.91
  Vertical 0.152: v23.22,21.19 23.27,21.25 23.27,23.5 23.78,24 23.78,27.18 v23.53,27.43
  Vertical 0.305: v20.99,46.61 20.99,45.28 23.21,43.05 23.21,40.89 v23.7,40.61
  Power 0.254: v59.67,21.25 59.85,20.66 59.82,20.63 59.82,20.94 59.97,21.09
  Bottom 0.15: U701.19 19.44,17.91 19.85,17.91 19.96,17.79 20.71,17.79 | U701.2 22.69,17.91 22.13,17.91 | v21.26,26.2 21.29,26.29 C201.P$1 20.75,26.8 20.35,26.8 19.85,26.3 R719.P$2 | 19.57,21.79 19.57,20.72 20.71,19.31 20.71,17.79 | C303.P$1 67.34,7.11 67.34,8.25 67.09,8.51 65.82,8.51 64.8,9.53 64.42,9.53 63.82,10.12 63.79,10.73 U301.3 | C302.P$1 64.06,12.83 | 53.4,11.78 v53.37,12.83 | 20.71,17.79 20.71,15.51 21.18,15.05 | 21.18,15.05 21.24,14.99 22.13,14.99 | 21.5,13.07 21.12,13.46 21.12,14.99 21.18,15.05 | 22.51,18.03 22.64,18.16 24.54,18.16 24.67,18.03 v24.67,17.91 | U201.19 23.08,21.33 v23.22,21.19
  Bottom 0.152: R215.P$2 24.17,32.3 v23.88,32 | R314.P$2 21.49,12.73 | R718.P$2 24.42,28.32 v23.53,27.43 | C703.P$1 18.73,26.3 R719.P$2 | U202.8 44.27,39.14 C202.P$1 | 75.09,14.1 U304.P$2
  Bottom 0.2: 67.22,12.96 v67.34,13.08 R305.P$1 | 67.1,8.52 67.09,8.51 | R304.P$1 68.1,9.01 67.34,8.25
  Bottom 0.25: v59.67,21.25 60.34,20.58 C506.P$1 59.9,20 C507.P$1
  Bottom 0.254: C302.P$1 64.05,11.66 63.83,11.44 63.81,10.78 U301.3 63.81,10.75 | U502.7 57.01,22.66 56.7,22.66 v56.22,23.08 | 19.57,21.79 U201.2 | U701.19 18.7,18.03 17.05,18.03 16.29,17.27 8.33,17.27 8.32,17.28 7.59,17.28 3.37,21.5 R502.P$2 | U701.2 22.51,18.03 22.31,18.03 | v19.93,33.27 19.46,33.27 19.08,32.89 19.08,31.88 19.21,31.7 U702.19 | U702.2 23.32,32 v23.88,32 | v63.34,21.59 62.37,20.84 C505.P$1 | v62.65,23.88 62.68,28.93 61.74,30.12 60.61,30.13 60.47,30.13 60.46,30.9 60.46,31.5 | R507.P$2 68.76,34.89 | 60.46,32.84 60.46,31.5 | 60.46,32.84 60.46,33.62 61.64,34.87 68.36,34.87 | 60.46,32.84 59.96,32.84 58.96,33.29 58.96,38.69 61.41,38.69 U302.2 61.51,38.69 61.96,38.69 62.21,38.94 62.21,42.39 U302.10 | 22.13,17.91 22.13,14.99 | 20.71,17.79 20.71,15.13 | 21.5,13.07 21.5,12.75 21.49,12.73 | U304.P$8 67.97,14.59 67.6,14.22 67.6,13.97 | 67.6,13.97 67.6,13.33 v67.34,13.08 | U304.P$7 67.72,14.09 67.6,13.97 | R302.P$2 R301.P$2 75.08,14.09 75.09,14.1 | U304.P$2 73.18,14.09 | 75.09,13.84 75.09,14.1 | 75.09,14.1 75.09,14.61 v74.96,14.73 | C704.P$1 2.33,41.76 X701.4 1.18,40.61 1.18,39.88 v1.68,39.37 | 5.11,42.8 5.11,39.24 | U706.25 v4.99,39.12 5.11,39.24 | 5.11,39.24 v7.78,39.24 | JP701.3 60.08,31.88 60.46,31.5
  Bottom 0.305: 68.36,34.87 68.76,34.89 | 60.52,30.84 60.47,30.13 | C702.P$1 21.35,46.97 v20.99,46.61 | 64.06,12.83 66.33,13.33 | C303.P$1 67.47,6.98 | U202.8 54.93,39.14 55.53,39.75 57.9,39.75 58.96,38.69 | R720.P$2 5.63,43.31 5.11,42.8
  Bottom 0.406: C304.P$1 62.38,43.47 62.34,42.61 62.41,42.69 U302.10 | 21.49,12.73 v21.12,12.32 | JP301.2 60.61,30.13 | SJ1.2 55.53,23.77 v56.22,23.08
  Bottom 1.27: v67.34,13.08 66.33,13.33 64.8,14.86 64.8,15.88 61.25,15.88 60.23,16.89 v59.72,17.14
  pour Power (isolate 0.406, rank 6): 61.49,44.97 61.49,16.89 78.01,16.89 78.27,-0.53 17.45,-0.41 17.87,44.54
  pour Power: 27.93,19.96 33.01,15.32 52.66,15.2 55.09,17.7 55.05,23.8 55.98,23.8 55.98,23.79 56.11,23.79 56.11,23.18 56.9,23.18 56.9,23.13 56.91,21.22 62.1,21.38 62.1,24.96 63.57,24.96 63.38,16.65 60.5,16.49 55.49,13 26.69,13 26.33,19.91
CAN1_RX_1  (via drill 0.2)
  Horizontal 0.15: 55.91,13.59 56.17,13.33 56.17,11.81 57.18,10.79 57.18,8.25 59.22,6.22 61.5,6.22 65.06,9.78 v65.06,10.79
  Horizontal 0.152: 55.91,13.59 54.9,14.61 54.14,14.61 53.37,15.37 v49.85,15.37 49.82,15.37
  Vertical 0.152: v48.64,45.22 48.64,17.31 49.82,16.13 v49.85,15.37
  Bottom 0.254: U301.4 64.47,10.92 64.48,10.93 64.48,10.79 v65.06,10.79 | v48.64,45.22 48.64,47.93 47.72,48.84 41.16,48.84 U$101.70
CAN1_TX_1  (via drill 0.2)
  Horizontal 0.152: 48.04,44.62 v48.09,44.57 | v59.22,16.13 58.96,16.13 56.93,18.16 51.09,18.16 v50.06,17.04
  Horizontal 0.254: 48.04,44.62 47.99,44.58 41.94,44.58 41.69,44.83 40.67,44.83 40.47,44.62 v40.17,44.62
  Vertical 0.152: v48.09,44.57 48.09,35.48 arc-90 47.64,35.07 47.74,24.38 48.15,23.97 48.14,17.08 48.17,15.88 48.17,14.61 50.13,13.78 v50.37,13.78 50.31,13.79 50.31,16.35 50.06,16.67 v50.06,17.04 | v62.52,9.53 62.52,13.33 60.23,16.13 v59.22,16.13
  Bottom 0.254: U$101.72 | U$101.72 38.31,49.15 38.31,46.33 39.71,45.44 40.17,44.98 v40.17,44.62 | U301.1 62.52,10.4 v62.52,9.53
CAN_H  (via drill 0.2)
  Top 0.254: 61.58,18.67 61.56,18.67 J307.2 61.34,18.59 CAN_H.P$1 58.45,18.49 58.45,15.88 58.71,15.62 59.98,15.62 61.76,13.84 61.76,12.83 63.14,11.44 v63.14,9.48
  Top 0.305: 61.58,18.67 60.98,18.9
  Bottom 0.15: v63.14,9.48 63.14,8.45 U301.7
  Bottom 0.254: U301.7 63.17,7.34 R309.P$1
CAN_L  (via drill 0.2)
  Top 0.254: 61.57,20.04 61.53,20.04 J307.3 | v63.79,9.47 63.77,11.82 62.52,13.08 62.52,16.13 63.03,16.64 63.53,16.64 63.79,16.89 63.79,19.18 63.03,19.94 61.54,19.94 J307.3 | J307.3 61.44,19.94 54.81,19.94 CAN_L.P$1
  Bottom 0.15: v63.79,9.47 63.77,8.46 U301.6
  Bottom 0.254: U301.6 63.82,7.49 R309.P$2 64.62,6.42
CH_1  (via drill 0.2)
  Vertical 0.15: U$101.28 33.31,3.35 33.31,5.46 29.5,9.27 26.45,9.27 25.69,10.03 24.67,10.03 24.16,10.54 v24.16,14.61
  Bottom 0.15: U701.5 23.51,16.53
  Bottom 0.152: 23.51,16.53 24.16,15.88 v24.16,14.61
CH_1_OUT  (via drill 0.2)
  Horizontal 0.254: v5.37,29.21 v4.35,29.21
  Bottom 0.15: U701.16 18.47,16.53 18.32,16.38 18.32,12.56 R714.P$1
  Bottom 0.254: U706.6 7.97,33.4 8.54,33.4 9.05,32.89 9.05,30.23 8.16,29.34 5.49,29.34 v5.37,29.21 | v4.35,29.21 4.35,29.34 3.46,28.45 2.32,28.45 1.3,27.43 1.3,18.92 8.03,12.19 16.54,12.19 17.05,11.68 R714.P$1
CH_2  (via drill 0.2)
  Vertical 0.15: 34.53,4.92 29.75,9.7 29.75,9.78 26.7,9.78 25.94,10.54 25.18,10.54 24.67,11.05 24.67,14.35
  Vertical 0.152: 34.53,4.92 U$101.27 | 24.67,14.35 v24.67,15.24
  Bottom 0.15: U701.4 22.93,17.14 24.16,17.14 24.42,16.89
  Bottom 0.152: 24.42,16.89 24.67,16.64 v24.67,15.24
CH_2_OUT  (via drill 0.2)
  Top 0.254: v3.46,15.49 4.22,14.73 v7.91,14.73
  Horizontal 0.254: v5.37,29.85 v4.35,29.85
  Bottom 0.15: U701.17 18.21,17.03 17.81,16.64 17.81,14.6 R713.P$1
  Bottom 0.254: U706.7 8.4,32.26 8.42,32.26 8.42,30.35 8.03,29.97 v5.37,29.85 | v4.35,29.85 4.35,29.97 3.59,29.21 2.19,29.21 0.8,27.81 0.8,17.4 2.7,15.49 v3.46,15.49 | R713.P$1 16.93,13.83 16.04,14.73 v7.91,14.73
CH_3  (via drill 0.2)
  Vertical 0.15: U$101.30 30.77,3.35 30.77,6.22 30.26,6.73 28.99,6.73 27.97,7.75 25.18,7.75 22.64,10.29 22.64,16.64 v23.66,17.65
  Bottom 0.15: U701.3 23.28,17.53 v23.66,17.65
  Bottom 0.152: U701.3 22.83,17.55
CH_3_OUT  (via drill 0.2)
  Horizontal 0.254: v17.31,17.14 17.18,17.27 14.64,17.27 14.13,16.76 14.13,15.11 13.75,14.73 8.92,14.73 8.16,15.49 v7.65,15.49
  Vertical 0.254: v7.53,31.12 7.53,28.45 7.4,28.32 4.48,28.19 v3.21,27.43
  Bottom 0.15: U701.18 17.69,17.53 | v17.31,17.14 17.05,16.89 R712.P$1
  Bottom 0.254: 3.21,27.18 v3.21,27.43 3.21,26.92 2.7,26.42 2.7,21.08 6.51,17.27 6.51,16.64 v7.65,15.49 | v7.53,31.12 6.94,31.71 U706.8 | 17.69,17.53 v17.31,17.14
CH_4  (via drill 0.2)
  Vertical 0.15: U$101.29 31.78,4.88 31.78,6.48 29.5,8.76 24.93,8.76 23.66,10.03 23.66,14.86 24.16,15.37 24.16,18.42 v23.91,18.67
  Bottom 0.15: v23.91,18.67 21.95,18.67 U701.1
CH_4_OUT  (via drill 0.2)
  Horizontal 0.254: v14.26,17.78 13.88,17.27 8.93,17.27 arc45 8.7,17.18 7.91,16.38 v5.62,16.38
  Vertical 0.254: v6.64,30.61 6.64,29.08 6.26,28.7 4.48,28.7 v2.57,27.81
  Bottom 0.15: R701.P$1 19.67,19.18 U701.20
  Bottom 0.254: U706.9 6.26,31.69 6.26,31.24 v6.64,30.61 | R701.P$1 17.94,19.3 17.94,19.56 17.69,19.81 14.38,19.81 14.13,19.56 14.13,17.91 v14.26,17.78 | v5.62,16.38 1.81,20.19 1.81,27.05 v2.57,27.81
CH_5  (via drill 0.2)
  Vertical 0.15: U$101.40 18.32,3.1 | 18.58,8.25 18.58,28.07 19.08,28.58 v22.13,28.58
  Vertical 0.152: 18.58,8.25 18.58,7.11 18.32,6.86 18.32,3.1
  Bottom 0.15: v22.13,28.58 22.51,28.2 U702.9
CH_5_OUT  (via drill 0.2)
  Top 0.254: v5.88,30.86 6,30.73 6,28.32 5.62,27.94 5.62,26.67 6.89,25.4 7.27,25.4 8.8,25.4 v9.3,24.89
  Horizontal 0.254: v9.3,24.89 13.88,24.89 14,24.77 14,22.99 14.64,22.35 v16.16,22.35
  Bottom 0.15: U702.12 18.96,28.2 18.07,27.3 18.07,22.47 R702.P$1
  Bottom 0.254: U706.10 5.62,31.71 5.62,31.12 v5.88,30.86 | v16.16,22.35 16.15,22.35 R702.P$1
CH_6  (via drill 0.2)
  Vertical 0.15: U$101.39 19.08,4.88 19.08,18.67 19.85,19.43 19.85,20.19 19.08,20.96 19.08,27.81 19.34,28.07 23.4,28.07 v23.91,28.58
  Bottom 0.15: v23.91,28.58 23.79,28.7 U702.8
CH_6_OUT  (via drill 0.2)
  Horizontal 0.254: v4.35,30.73 4.48,30.61 5.37,30.61 5.88,30.1 7.02,30.1 v8.29,28.83
  Bottom 0.152: 17.05,24.51 17.56,25.15 17.56,27.3 18.95,28.7 U702.13
  Bottom 0.254: U706.12 4.35,31.12 v4.35,30.73 | v8.29,28.83 8.42,28.83 9.81,27.43 11.34,27.43 11.59,27.05 11.59,25.15 11.97,24.89 16.67,24.89 17.05,24.51 R703.P$1
CH_7  (via drill 0.2)
  Vertical 0.15: U$101.42 16.75,2.87 17.81,3.94 | 18.19,8.38 18.19,28.19 18.83,29.08 v21.73,29.06
  Vertical 0.152: 17.81,3.94 17.81,7.24 18.19,7.62 18.19,8.38
  Bottom 0.15: v21.73,29.06 21.99,29.2 U702.7
CH_7_OUT  (via drill 0.2)
  Horizontal 0.254: v3.34,29.85 3.34,29.08 3.97,28.45 6.38,28.45 6.51,28.32 8.92,28.32 9.81,27.43 v14.51,27.43
  Bottom 0.152: R704.P$1 17.18,26.66 17.18,27.43 18.94,29.2 U702.14
  Bottom 0.254: U706.13 3.72,31.69 3.72,30.61 3.34,30.23 v3.34,29.85 | v14.51,27.43 17.18,27.43
CH_8  (via drill 0.2)
  Vertical 0.15: 17.81,8.76 17.81,27.94 | 18.58,29.59 v21.37,29.59
  Vertical 0.152: 17.81,8.76 16.54,7.49 16.54,4.88 U$101.41 | 17.81,27.94 17.81,28.83 18.58,29.59
  Bottom 0.15: v21.37,29.59 22.89,29.59 U702.6
CH_8_OUT  (via drill 0.2)
  Horizontal 0.254: v9.43,29.85 13.62,29.85 v14,30.23
  Vertical 0.254: v3.08,30.86 3.08,32.13 7.4,32.13 8.54,30.99 8.54,30.48 v9.43,29.85
  Bottom 0.15: U702.15 17.42,29.7 R705.P$1
  Bottom 0.254: U706.14 3.08,31.72 v3.08,30.86 | v14,30.23 14.26,29.97 16.41,29.97 R705.P$1
CH_9  (via drill 0.2)
  Vertical 0.15: U$101.44 14.21,2.36 15.53,3.68 | 18.32,30.1 v24.04,30.1
  Vertical 0.152: 15.53,3.68 15.53,5.71 16.16,6.35 16.16,8.13 17.05,9.02 17.05,16.64 16.8,16.89 16.8,17.53 17.18,17.91 17.18,28.96 18.32,30.1
  Bottom 0.15: U702.5 23.12,30.1 v24.04,30.1
CH_9_OUT  (via drill 0.2)
  Vertical 0.254: v1.05,32.77 7.53,32.77 7.65,32.64 v11.21,32.64
  Bottom 0.15: U702.16 18.47,30.2 R706.P$1
  Bottom 0.152: v11.21,32.64 16.04,32.64 R706.P$1
  Bottom 0.254: U706.15 1.99,32.77 v1.05,32.77
CH_10  (via drill 0.2)
  Horizontal 0.152: v11.84,7.49 11.84,9.53 12.1,9.78 v16.29,9.78
  Vertical 0.15: 18.13,30.77 v20.38,30.77
  Vertical 0.152: 18.13,30.77 16.67,29.32 16.67,18.03 16.29,17.65 16.29,16.89 16.54,16.64 16.54,10.03 v16.29,9.78 | U$101.43 14.21,4.88 11.84,7.24 v11.84,7.49
  Bottom 0.15: U702.4 22.98,30.73 22.51,30.73 21.88,30.1 21.12,30.1 20.45,30.77 v20.38,30.77
CH_10_OUT  (via drill 0.2)
  Vertical 0.254: v1.05,33.4 7.15,33.4 8.8,35.05 v16.54,35.05
  Bottom 0.15: U702.17 18.74,30.7 17.81,31.62 17.81,32.88 R707.P$1
  Bottom 0.254: U706.16 2.01,33.4 v1.05,33.4 | v16.54,35.05 17.05,34.54 R707.P$1
CH_11  (via drill 0.2)
  Vertical 0.15: 14,11.3 14,16.76 13.88,16.76 13.75,16.89 | 13.88,18.03 14.13,18.54 14,29.59 14.51,30.1 16.54,30.1 18.07,31.37 18.45,31.75 23.15,31.75 23.53,31.37 v23.91,31.37
  Vertical 0.152: U$101.46 11.67,2.87 12.73,3.94 12.73,5.59 10.96,7.37 10.96,8.89 11.84,9.78 13.75,9.78 14,10.03 14,11.3 | 13.75,16.89 13.75,17.78 13.88,18.03
  Bottom 0.15: U702.3 23.1,31.12 23.78,31.12 23.78,31.37 v23.91,31.37
CH_11_OUT  (via drill 0.2)
  Vertical 0.152: v8.92,35.56 8.03,35.56 6.51,34.04 2.83,34.04 2.81,34.02 0.94,34.02 v0.92,34.04
  Bottom 0.15: U702.18 19,31.2 18.32,31.88 18.32,35.68 R708.P$1
  Bottom 0.152: R708.P$1 17.69,36.2 17.69,36.58 17.56,36.58 17.31,36.83 16.67,36.83 15.91,37.59 14.51,37.59 14.13,37.21 14.13,35.43 13.75,35.05 9.43,35.05 v8.92,35.56 | U706.17 2.02,34.04 v0.92,34.04
CH_12  (via drill 0.2)
  Vertical 0.15: 11.46,10.03 11.46,32.13 11.97,32.64 20.61,32.64 v21.58,33.87
  Vertical 0.152: 11.67,4.78 U$101.45 10.45,5.89 10.45,9.02 11.46,10.03
  Bottom 0.15: v21.58,33.87 21.58,32.64 U702.1
CH_12_OUT  (via drill 0.2)
  Horizontal 0.152: 15.91,37.59 16.04,37.72 | 16.04,37.72 16.42,38.1 v17.18,38.1 | v11.59,37.72 16.04,37.72
  Vertical 0.152: v1.18,34.8 6.51,34.8 7.91,36.2 8.16,36.2 9.69,37.72 v11.59,37.72
  Bottom 0.15: U702.20 20.52,36.02 R709.P$1
  Bottom 0.152: 17.81,38.6 R709.P$1 v17.18,38.11 v17.18,38.1
  Bottom 0.254: U706.18 1.3,34.67 v1.18,34.8
FMU-CH6-PROT
  Bottom 0.15: R708.P$2 15.53,36.2 U704.31
FMU-VDD_5V5
  Bottom 0.254: C502.P$1 arc90 60.64,23.71 L501.P$2 arc-90 58.72,23.23 | 58.72,23.23 U502.1 | 59.71,21.73 arc90 C501.P$1 arc90 59.1,23.23 58.72,23.23
FMU_AUX_ADC1_PROT  (via drill 0.2)
  Top 0.254: v51.07,42.82 50.63,44.54
  Top 0.305: J309.4 50.66,44.51 50.63,44.54
  Bottom 0.15: R6.P$2 50.58,43.44 R311.P$2 50.68,43.19 v51.07,42.82
FMU_AUX_ADC2_PROT  (via drill 0.2)
  Top 0.254: v53.72,42.96 53.21,44.46
  Top 0.305: J309.2 53.16,44.42 53.21,44.46
  Bottom 0.15: R310.P$2 53.12,43.31 | 53.12,43.31 53.38,43.31 v53.72,42.96 | R5.P$2 53.12,43.31
GND  (via drill 0.2, 0.3, 0.38, 0.6)
  Top 0.15: U$201.P$7 U$2.P$8 21.9,17.89 U$2.6 | D706.A 17.29,7.86 v17.77,7.82 | U$201.6 20.75,28.37 v21.33,27.61
  Top 0.152: 40.97,29.37 v42.34,29.37 | GND..P$1 58.14,35.36 v57.88,35.62
  Top 0.2: v70.3,11.97 70.14,11.81
  Top 0.254: 62.94,42.83 v64.98,42.8 | 49.32,44.49 v49.32,45.65 | v68.2,38 68.19,37.99 GND.P$1 | 26.4,47.92 R102.P$1 26.46,47.85 v23.54,47.85 23.42,47.97 U$11.P$4 | 26.48,35.17 R613.P$2 26.46,35.39 v26.46,36.24 D601.A | L202.P$4 L202.P$5 L202.P$3 | v62.55,22.1 61.4,21.34 J307.4 | 59.48,8.25 L303.P$5 61.24,8.25 J314.P$6 | 64.3,23.69 64.3,22.73 65.06,21.97 65.06,20.7 64.3,19.94 64.3,15.04 J307.P$5 | v20.35,46.61 20.35,46.08 U$11.2 | v21.56,43.43 22,43.43 U$11.P$3 U$12.P$5 | U$201.P$8 U$12.P$4 24.33,32.6 24.54,32.38 v24.54,31.66 | v23.91,20.7 23.4,20.7 22.26,19.56 22.13,19.43 | J314.4 63.69,7.63 63.71,7.4 63.7,5.82 65.82,5.83 66.13,5.52 v66.24,5.52 | J314.P$5 69.89,11.56 70.14,11.81 | 74.54,5.96 74.54,5.95 U$101.P$3 | v63.28,34.29 63.28,33.8 J308.P$5 | v70.3,11.97 73.13,11.97 73.42,11.68 v73.57,11.68 | 27.37,28.08 v27.23,28.22
  Top 0.305: C801.P$2 68.22,38.73 v68.2,38 | J305.3 62.92,43.99 62.94,42.83 | J305.P$5 62.56,46.95 L301.P$5 | J308.4 63.26,39.15 v64.87,37.54 | J308.P$6 64.13,42.32 v64.98,42.8 | J309.P$7 44.96,46.95 U$101.93 | J309.5 49.41,44.39 49.32,44.49 | J309.3 51.9,44.25 51.85,44.2 v51.85,45.59 | J309.P$6 55.19,46.95 55.15,46.99 55.15,48.12 L302.P$5 | 23.17,48.22 v23.54,47.85
  Top 0.406: v25.51,9.49 25.72,9.49 D202.A | J307.P$5 63.5,15.04 v63.5,13.63 | 64.3,23.69 J307.P$6 | L201.P$3 L201.P$5 L201.P$4 18.31,19.69 D201.A | U$2.P$7 28.01,6.74 L202.P$4 | U$201.P$7 22.15,19.66 22.26,19.56
  Top 0.61: 74.88,45.44 71.26,45.44 69.92,46.78 | J308.P$5 64.13,30.92 v64.59,30.46 | J801.6 J801.5 | J314.P$6 J306.P$5 52.63,9.8 | 52.63,9.8 51.72,8.89 51.72,7.2 J306.4 | 52.63,9.8 J306.P$6 J310.P$5 J310.P$6 39,9.8 39.78,9.02 39.78,7.13 J310.4 | 69.92,46.78 69.75,46.95 J305.P$4 | U$101.TP8 69.92,46.75 69.92,46.78 | v67.85,46.35 v67.85,47.62
  Top 1.016: U704.42 U704.39 10.18,41.31 10.18,39.06 10.3,38.95 U704.36 10.23,38.82 10.23,37.61 10.3,37.54 U704.33 U704.30 U704.27 U704.24 U704.21 U704.18 U704.15 | U704.12 U704.9 U704.6 U704.3
  Ground 0.15: v37.12,21.21 36.86,21.21
  Ground 0.152: v27.28,17.08 27.28,16.96 27.47,16.76
  Ground 0.254: 41.41,26.4 41.38,26.4 | 61.9,12.68 64.63,12.68 | 8.95,25.93 8.28,25.76 8.1,25.2 | v64.87,37.54 63.51,37.51 63.51,37.52
  Ground 0.305: v57.99,24.52 57.64,24.52 | 51,21.21 51,21.2 | v51.85,45.59 52.1,45.85 | v30.77,21.15 31.15,21.99 v31.48,22.45
  Power 0.254: 5.11,42.04 3.72,42.04 2.95,42.8 | v2.7,43.81 2.7,43.69
  Power 0.406: v8.92,50.8 8.8,50.67
  Bottom 0.15: U1.4 38.01,20.32 v37.12,21.21 | U2.4 46.69,20.62 v47.28,21.21 | 39.4,17.4 39.02,17.78 U1.2 | 39.4,17.4 39.4,17.35 U1.1 | 39.4,17.4 v40.42,16.38 40.42,15.27 C101.P$2 | D301.A 74.47,11.66 | C303.P$2 65.67,7.05 65.74,6.98 | C411.P$2 45.36,23.76 45.5,23.62 45.69,23.62 C410.P$2
  Bottom 0.152: U503.6 74.88,35.75 | 77.86,35.65 77.76,35.69 76.61,35.69 76.49,35.56 76.36,35.56 76.23,35.69 75.74,35.69 | L801.P$4 75.14,36.3 U503.P$3 | U405.20 | U405.18 43.09,29.15 | v21.33,27.61 20.76,27.5 U702.11 20.52,27.47 20.1,27.3 R719.P$1 18.73,27.3 C703.P$2 | 31.53,23.24 v31.48,22.45 | C305.P$2 27.79,17.6 v27.28,17.08 | R215.P$1 24.54,32.51 v24.54,31.66 | R314.P$1 20.52,11.56 20.57,11.51 | 20.52,27.58 20.52,27.35 | v27.23,28.22 R718.P$1 | 43.11,32.51 U202.1 | U202.2 U202.3 U202.4 | 41.72,32.48 41.94,32.26 | C403.P$2 59.48,43.81 58.71,44.58 U404.3 58.71,45.72 58.58,45.97 57.82,45.97 57.63,45.66 | U404.1 57.71,45.58 57.63,45.66 | 57.63,45.66 v56.93,46.35 | U102.4 31.28,20.32 31.53,20.07 31.53,21.08 31.66,21.21 31.66,21.84 32.29,22.48
  Bottom 0.2: U405.20 v43.94,30.24 | 43.09,29.15 v42.34,29.37 | U405.11 43.93,24.55 v43.98,24.48 | 70.26,12 v70.3,11.97
  Bottom 0.254: U602.4 23.51,47.33 R607.P$2 C604.P$2 23.54,48.48 | 20.37,46.08 C603.P$2 20.37,43.32 | 20.37,46.08 R603.P$2 | 20.37,46.08 20.37,47.12 20.37,47.2 C702.P$2 v20.35,46.61 | v21.56,43.43 19.71,43.33 | 23.54,48.48 | 23.54,48.48 v23.54,47.85 | C301.P$2 66.64,47.48 R303.P$1 | C415.P$2 48.03,26.03 v47.2,27.17 | U502.2 57.87,22.73 U502.GND 57.87,21.33 v58,21.33 | U301.2 63.28,11.56 63.53,11.81 63.53,12.32 63.17,12.68 63.17,12.71 arc90 C302.P$2 63.18,13 63.23,13.66 63.62,13.68 v63.5,13.63 | U301.5 65.74,7.11 65.74,6.98 65.71,5.97 66.16,5.52 v66.24,5.52 | C502.P$2 60.39,25.26 60.39,24.85 60.05,24.51 L501.P$3 | 64.59,30.42 v64.59,30.46 64.59,29.97 64.56,29.94 64.3,29.59 | 17.09,7.1 v17.77,7.82 | L701.P$3 L701.P$5 L701.P$4 | 20.48,11.6 20.57,11.51 22.71,9.37 25.14,9.37 v25.51,9.49 | U201.11 22.48,26.31 v22.48,26.62 22.29,26.82 C201.P$2 | v45.84,23.17 45.79,23.22 C410.P$2 | C501.P$2 61.21,22.23 v61.21,22.82 | R802.P$2 72.75,35.25 U503.2 74.58,35.25 arc-90 U503.P$2 | C504.P$2 6.12,25.13 U501.P$3 6.27,24.12 U501.6 | U501.2 5.87,23.62 arc90 U501.GND U501.P$2 | U$101.80 28.13,49.17 29.01,49.17 29.32,48.86 29.46,48.86 29.93,48.39 C602.P$2 30.17,47.49 30.79,46.87 30.79,46.33 32.1,45.02 32.79,45.02 R608.P$1 | L301.P$3 L301.P$5 L301.P$4 | R501.P$2 8.16,24.67 8.16,25.15 v8.92,25.91 9.2,26.19 U704.21 | U702.11 20.52,27.58 | C507.P$2 58.67,18 v57.69,16.39 | C506.P$2 61.3,20.41 arc203 61.25,20.45 61.25,21.21 v62.55,22.1 | C505.P$2 62.16,18.83 v63.04,18.21 | R505.1 53.17,22.36 v52.87,22.73 | C509.P$2 58.3,28.58 v58.13,28.75 | 58.06,29.57 57.8,29.57 C508.P$2 | C510.P$2 64.62,37.51 v64.87,37.54 | U302.11 63.96,42.87 v64.98,42.8
  Bottom 0.254: D303.A 60.44,8.21 L303.P$5 | 74.47,11.66 v73.57,11.68 | R716.P$1 18.92,46.03 C702.P$2 | R509.P$2 63.27,34.28 v63.28,34.29 | L802.P$3 74.96,43.3 R807.P$2 76.11,44.7 | R808.P$2 74.33,55.11 v74.33,55.5 | 41.94,32.26 41.94,29.77 v42.34,29.37 | U503.6 75.74,35.69 | C404.P$2 C405.P$2 33.31,36.07 | 33.31,36.07 33.82,36.07 35.21,34.67 37.09,34.67 U202.4 | U403.7 33.31,38.2 33.31,36.07 | U304.P$1 71.52,14.59 70.65,13.72 70.65,12.32 v70.3,11.97 | C704.P$2 3.5,43.01 X701.2 | R721.P$2 10.13,38.73 U704.36 | 4.86,31.59 U706.11 | 3.59,42.42 3.46,42.42 3.46,43.05 v2.7,43.81 | R722.P$2 48.72,25.66 47.56,26.82
  Bottom 0.305: U503.P$3 arc90 74.88,35.75 74.88,35.65 U503.GND U503.P$2 | 77.86,35.65 R506.P$2 R504.P$2 | L802.P$3 L802.P$5 L802.P$4 L801.P$3 L801.P$5 L801.P$4 | D302.A v49.31,45.66 v49.32,45.65 49.32,44.58 R311.P$1 | L302.P$3 L302.P$5 L302.P$4 | 64.55,30.35 64.59,30.42 | 20.31,12.91 U701.11 | 57.88,36.9 U401.2 U401.3 56.11,35.62 v57.88,35.62 | L501.P$3 L501.P$5 L501.P$4 57.99,24.51 v57.99,24.52 | 45.85,23.16 v45.84,23.17 | v47.2,27.17 47.23,27.15 47.56,26.82 48.48,25.9 C413.P$2 49.09,24.16 | 52.27,23.48 v52.87,22.73 | R801.P$2 71.54,38.21 v71.48,38.59 | U102.4 30.75,20.24 v30.77,21.15 | R315.P$2 61.76,7.12 61.63,7.24 61.63,8.05 L303.P$4 L303.P$5 L303.P$3 60.26,8.21 D303.A | R310.P$1 51.85,44.52 v51.85,45.59 | U706.PAD U706.11 | C504.P$2 4.86,26.86 4.86,31.59
  Bottom 0.406: C304.P$2 U302.11 | 65.01,22.82 v61.21,22.82 | C702.P$2 20.35,47.14 20.37,47.12 | 58.06,29.57 58.06,28.82 v58.13,28.75 | 57.88,36.9 57.88,37.06 C401.P$2 | R226.P$1 v4.22,52.2 | R227.P$1 9.31,51.19 v8.92,50.8 | C202.P$2 44.36,33.15 43.72,32.51 43.11,32.51 | U202.1 U202.2 | U202.4 41.72,32.48 | X701.2 3.59,42.48 3.59,42.42
  Bottom 0.61: R303.P$1 67.78,46.35 v67.85,46.35 68.21,46.71 U$101.TP8
  Bottom 1.016: U704.15 U704.12
  other vias: 57.95,23.75 74.46,5.71 61.25,10.29 21.37,6.73 21.62,30.86 22.89,32.64 21.37,40.26 21.37,42.04 21.37,48.13 47.02,46.1 47.02,47.62 56.93,47.62 60.23,47.62 60.23,46.35 77.5,48.64 64.55,32.64 63.03,41.78 22.51,19.94 63.79,23.62 63.28,14.48 69.76,9.02 22.51,6.73
  pour Ground (isolate 0.254): -3.47,64.2 7.4,63.05 89.04,64.05 89.3,-1.55 73.65,-1.97 -2.43,-1.14
  pour Bottom (isolate 0.254, rank 3): -2.25,62.61 87.66,62.1 87.92,33.15 67.34,33.15 67.34,16.13 86.9,16.13 86.9,-0.89 -3.52,-0.38
  pour Top (isolate 0.254): -2.63,62.61 88.04,62.61 87.92,32.89 67.09,32.89 67.09,16.13 87.16,16.13 87.41,-0.38 -3.27,-0.13
  pour Power (isolate 0.254): 10.72,4.69 10.73,0.86 7.65,1.63 4.86,3.3 1.69,6.99 0.41,11.3 0.54,43.94 2.19,48.66 1.3,51.45 2.19,52.45 10.79,52.45 17.56,54.61 20.99,56.52 20.99,59.45 23.76,59.45 58.25,59.19 68.49,56.9 68.49,54.1 70.9,54.1 70.9,53.76 73.74,53.76 74.86,53.98 75.01,48.74 63.17,48.87 63.14,51.52 57.99,51.39 57.79,49.31 9.63,49.14 8.63,48.14 6.19,48.14 5.86,47.81 4.3,47.81 3.3,46.81 3.3,14.03 8.41,8.92 11.41,8.92 12.3,8.03 12.3,6.15 10.85,4.7
  pour Power: 69.25,14.73 72.3,14.73 72.3,13.84 71.66,13.84 71.66,12.83 70.39,11.56 68.49,11.94 68.11,12.32 68.11,14.48
I2C2_SCL  (via drill 0.2)
  Top 0.152: v23.15,52.58 22.26,51.69 18.19,51.69 18.07,51.56 13.24,51.56 12.99,51.31 12.99,49.15 12.61,48.77 12.23,48.77 11.97,48.51 11.97,46.1 11.21,45.34 9.3,45.34 8.03,44.07 v8.03,40.89